# EAGLE schematic Cablaggio_Vettura_AfterHockenheim (EAGLE 7.5.0)

## Sheet 1 of 7: Main
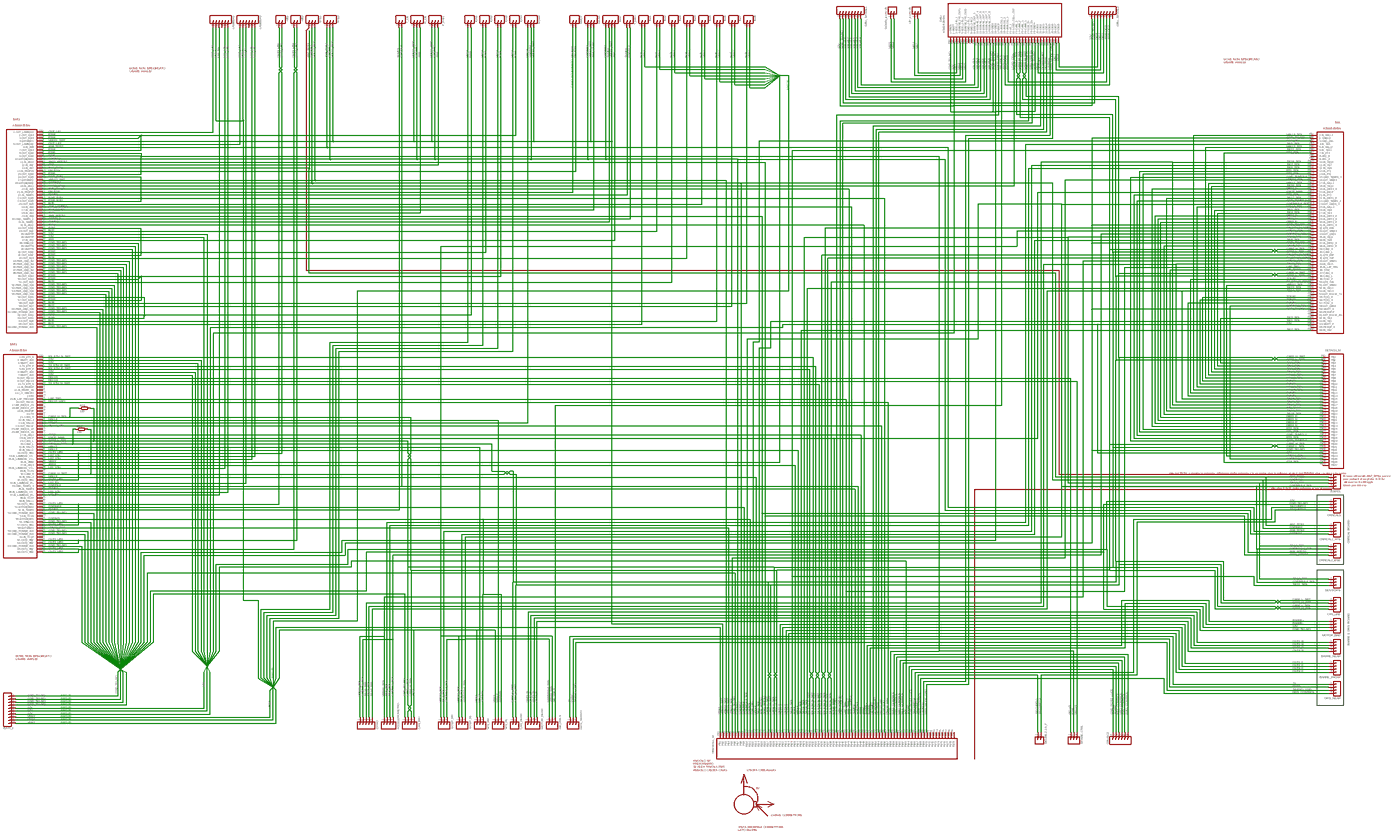
[diagram p0: schematic, sheet 1, overview]
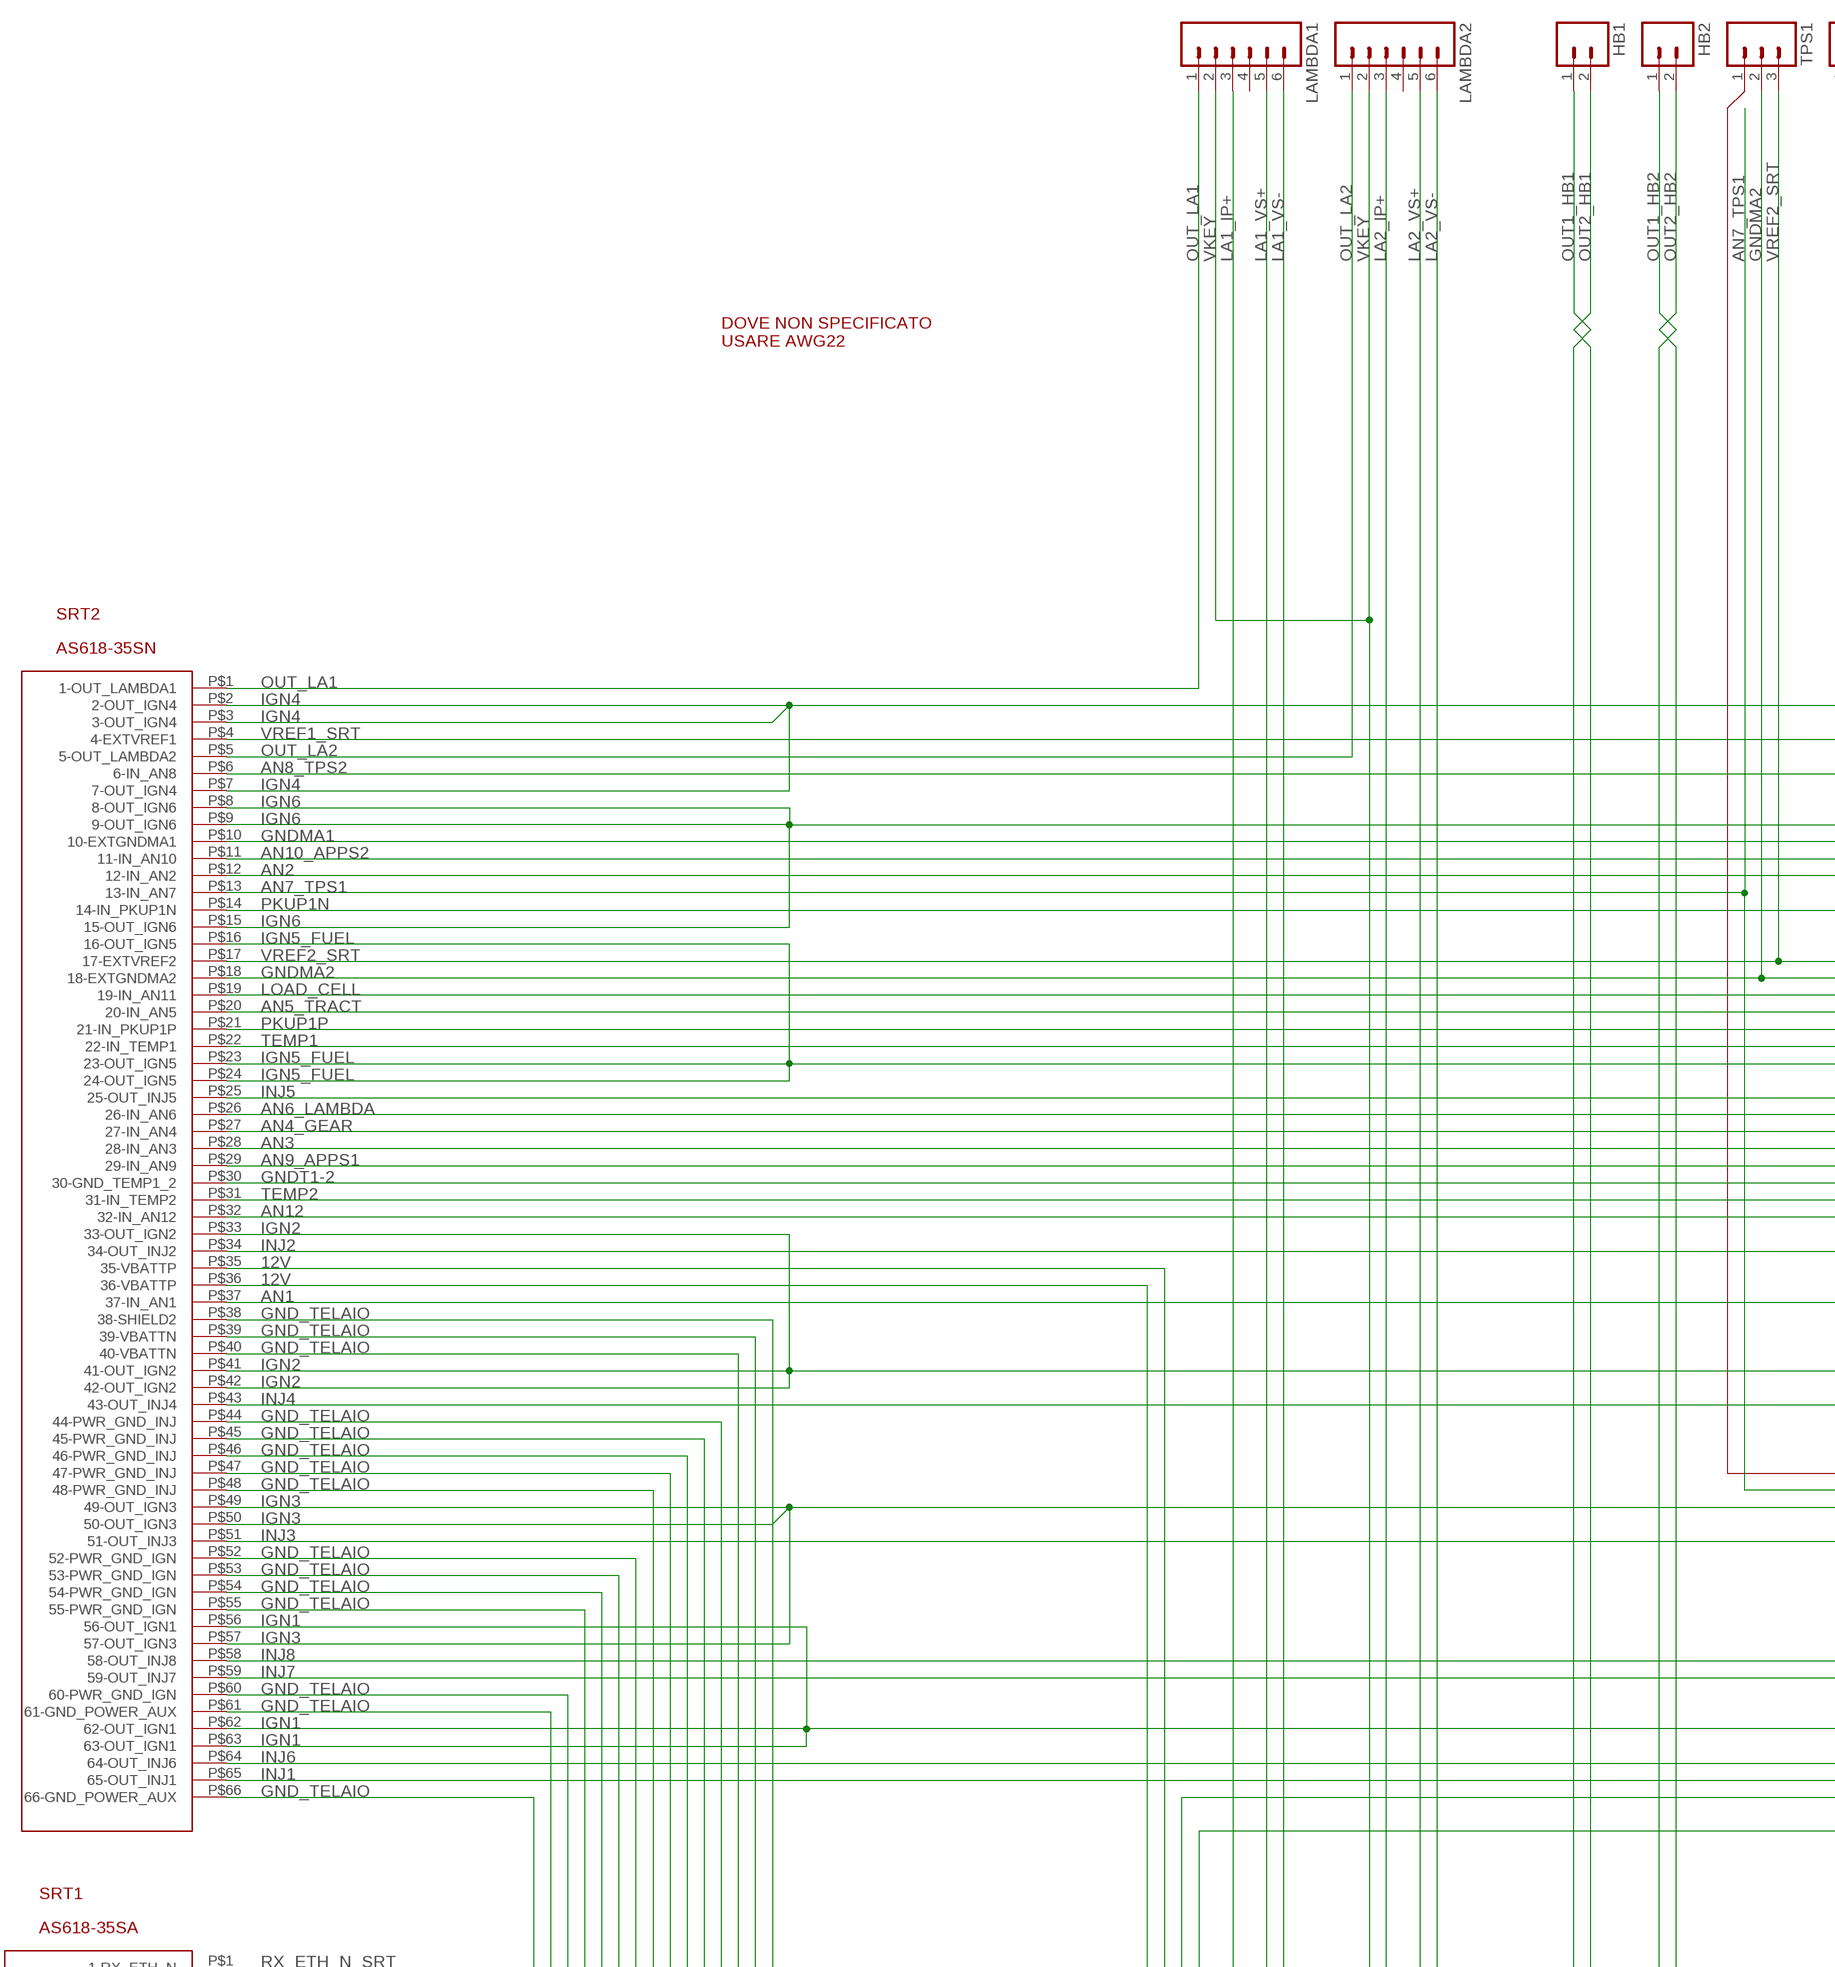
[diagram p1: schematic, sheet 1, part 1 of 8]
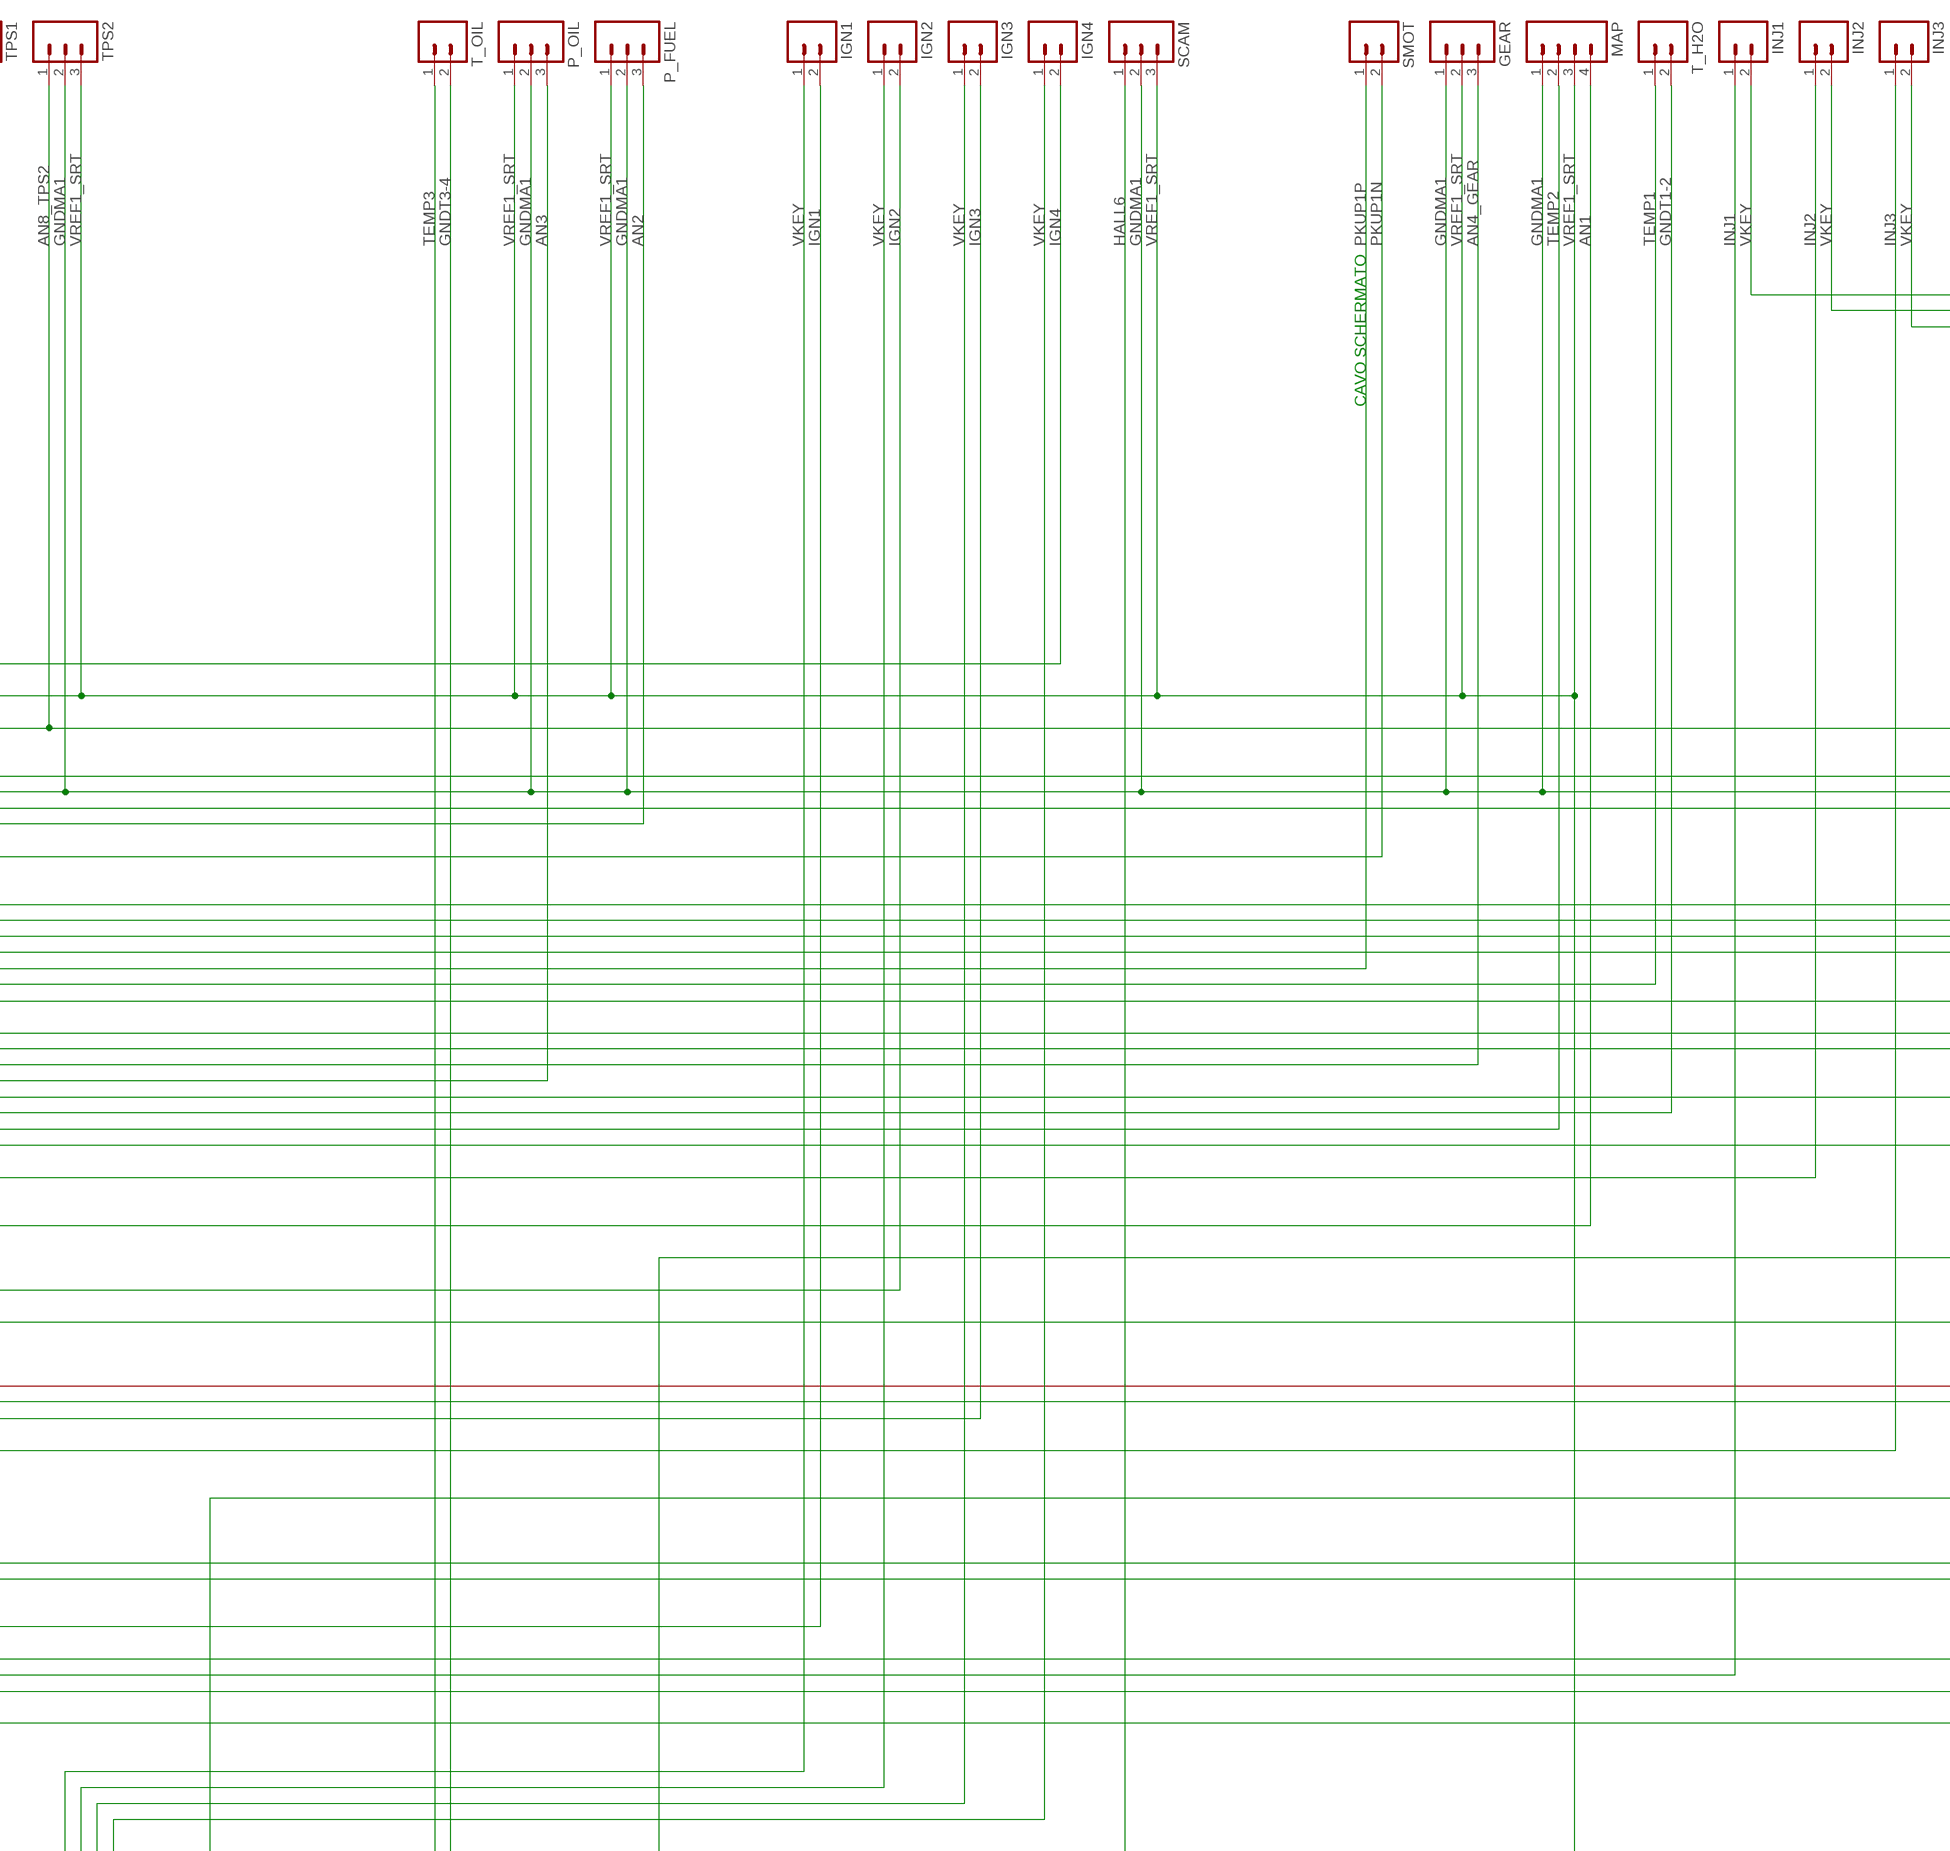
[diagram p2: schematic, sheet 1, part 2 of 8]
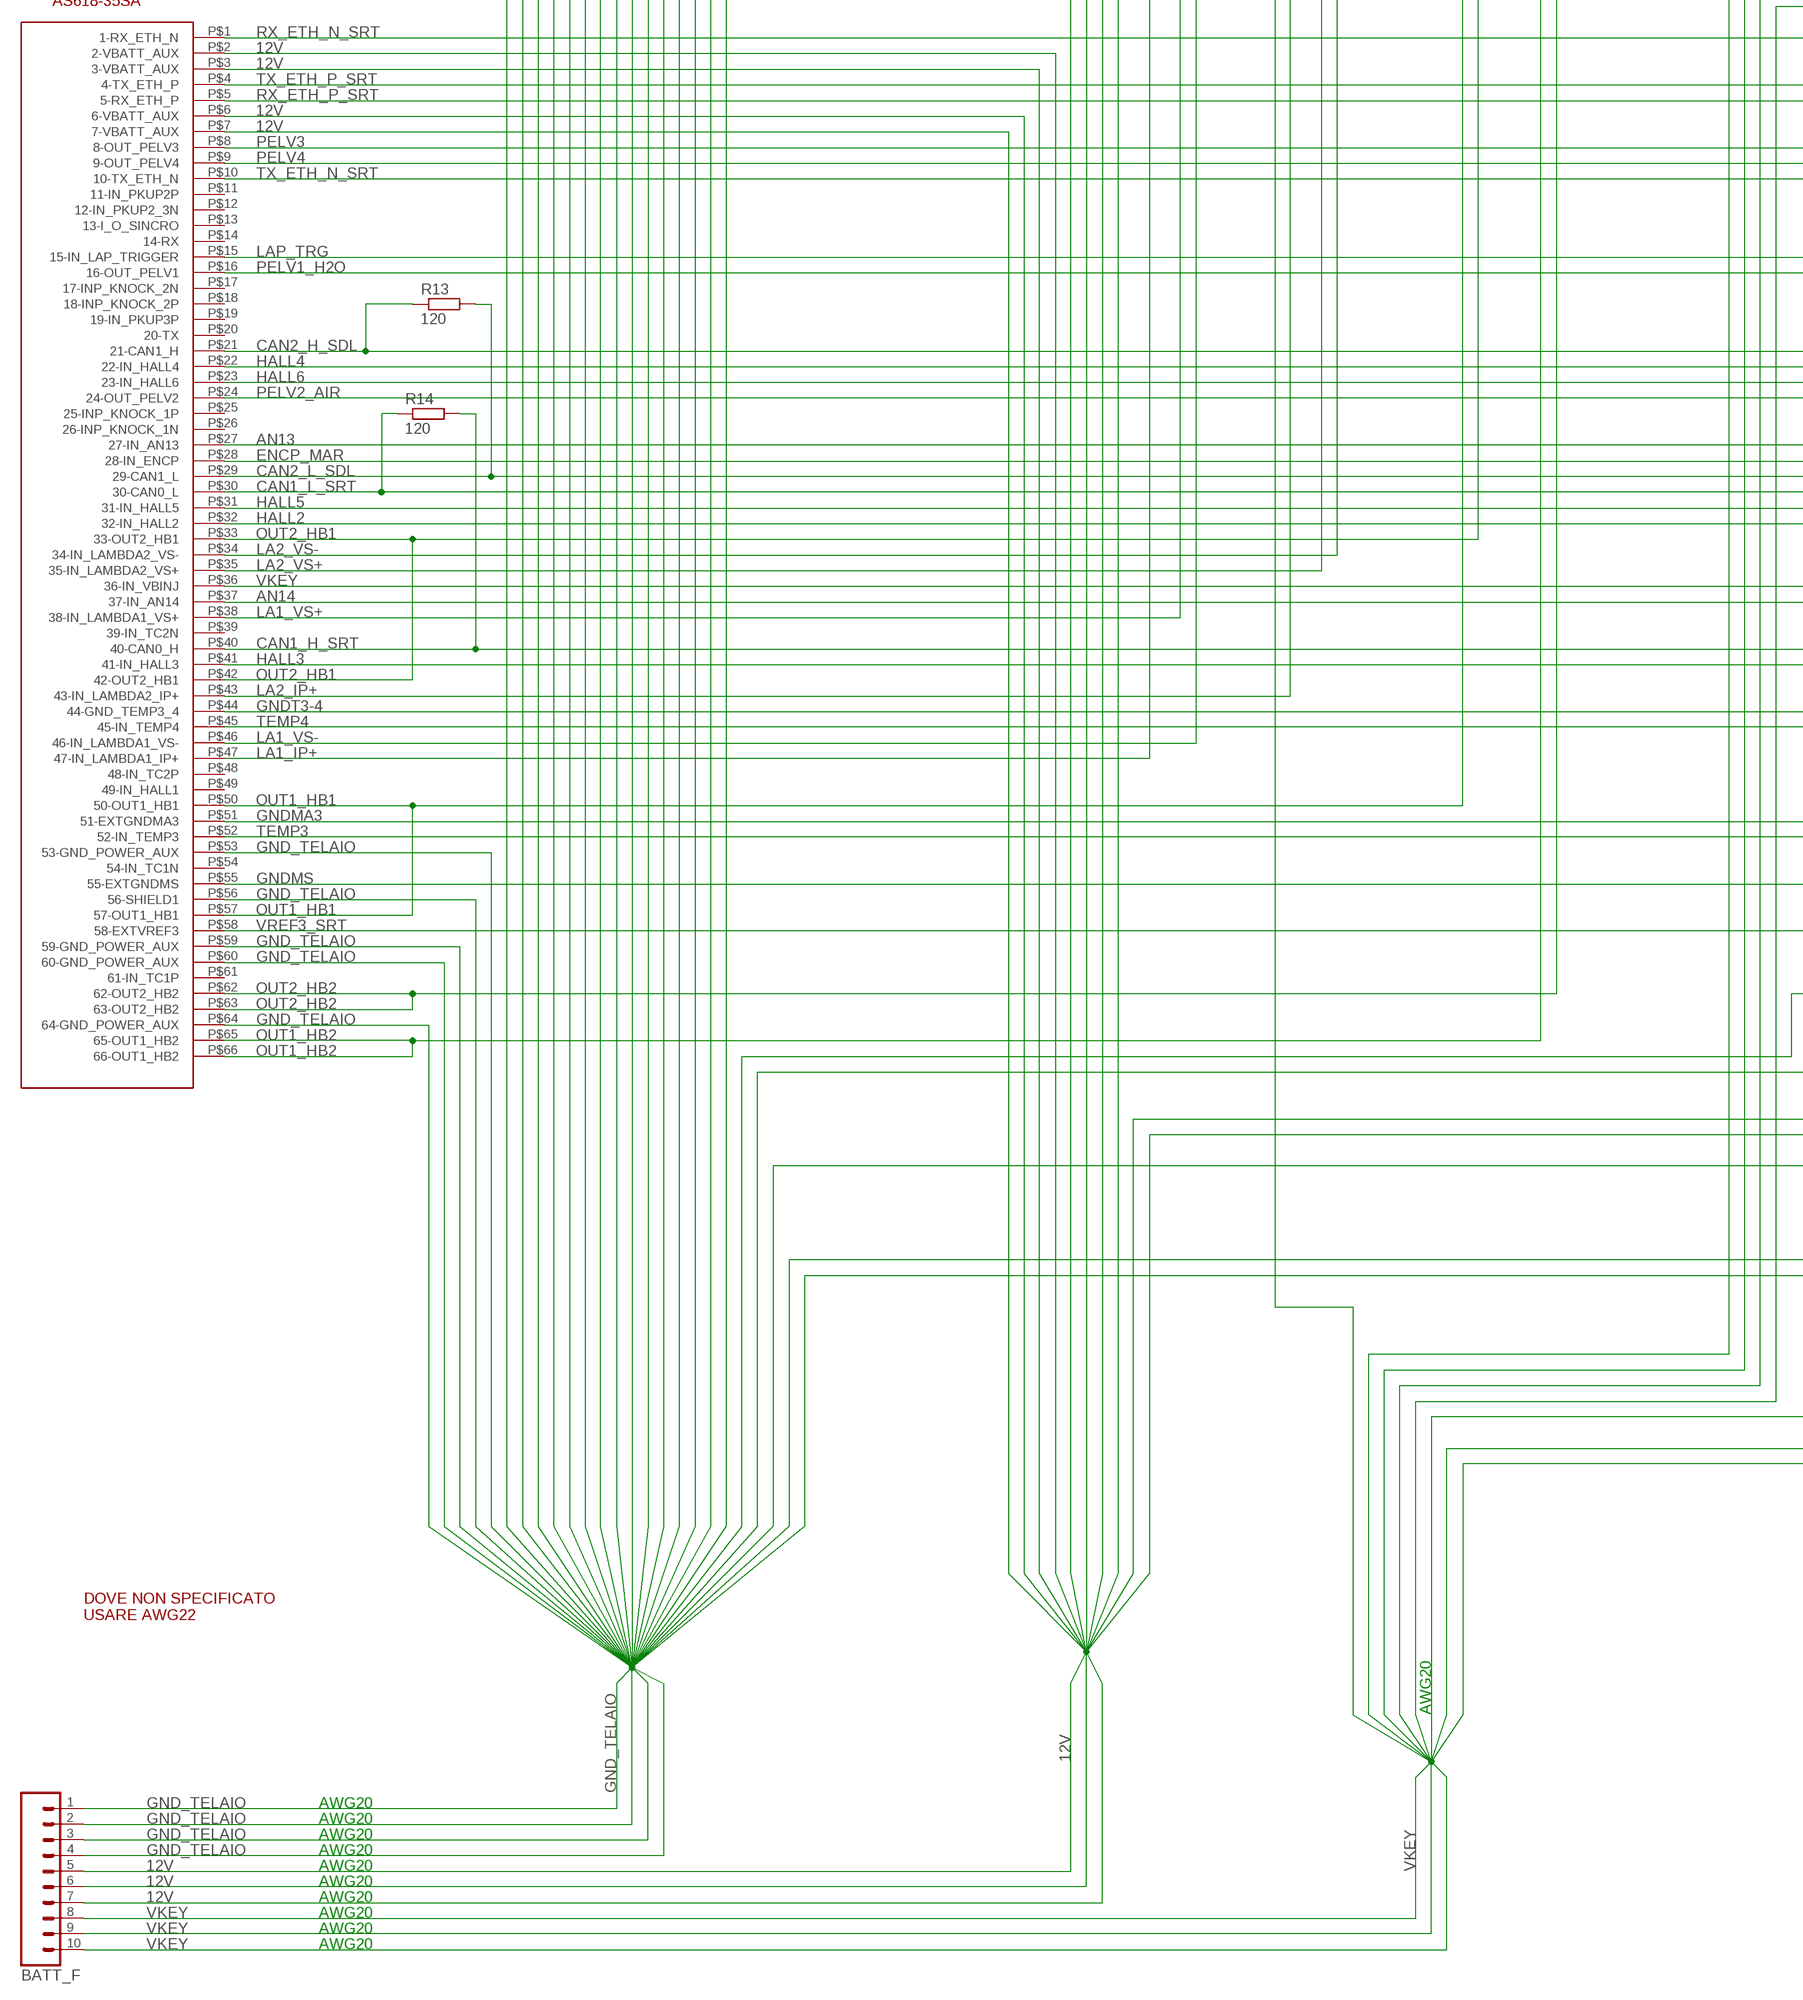
[diagram p3: schematic, sheet 1, part 3 of 8]
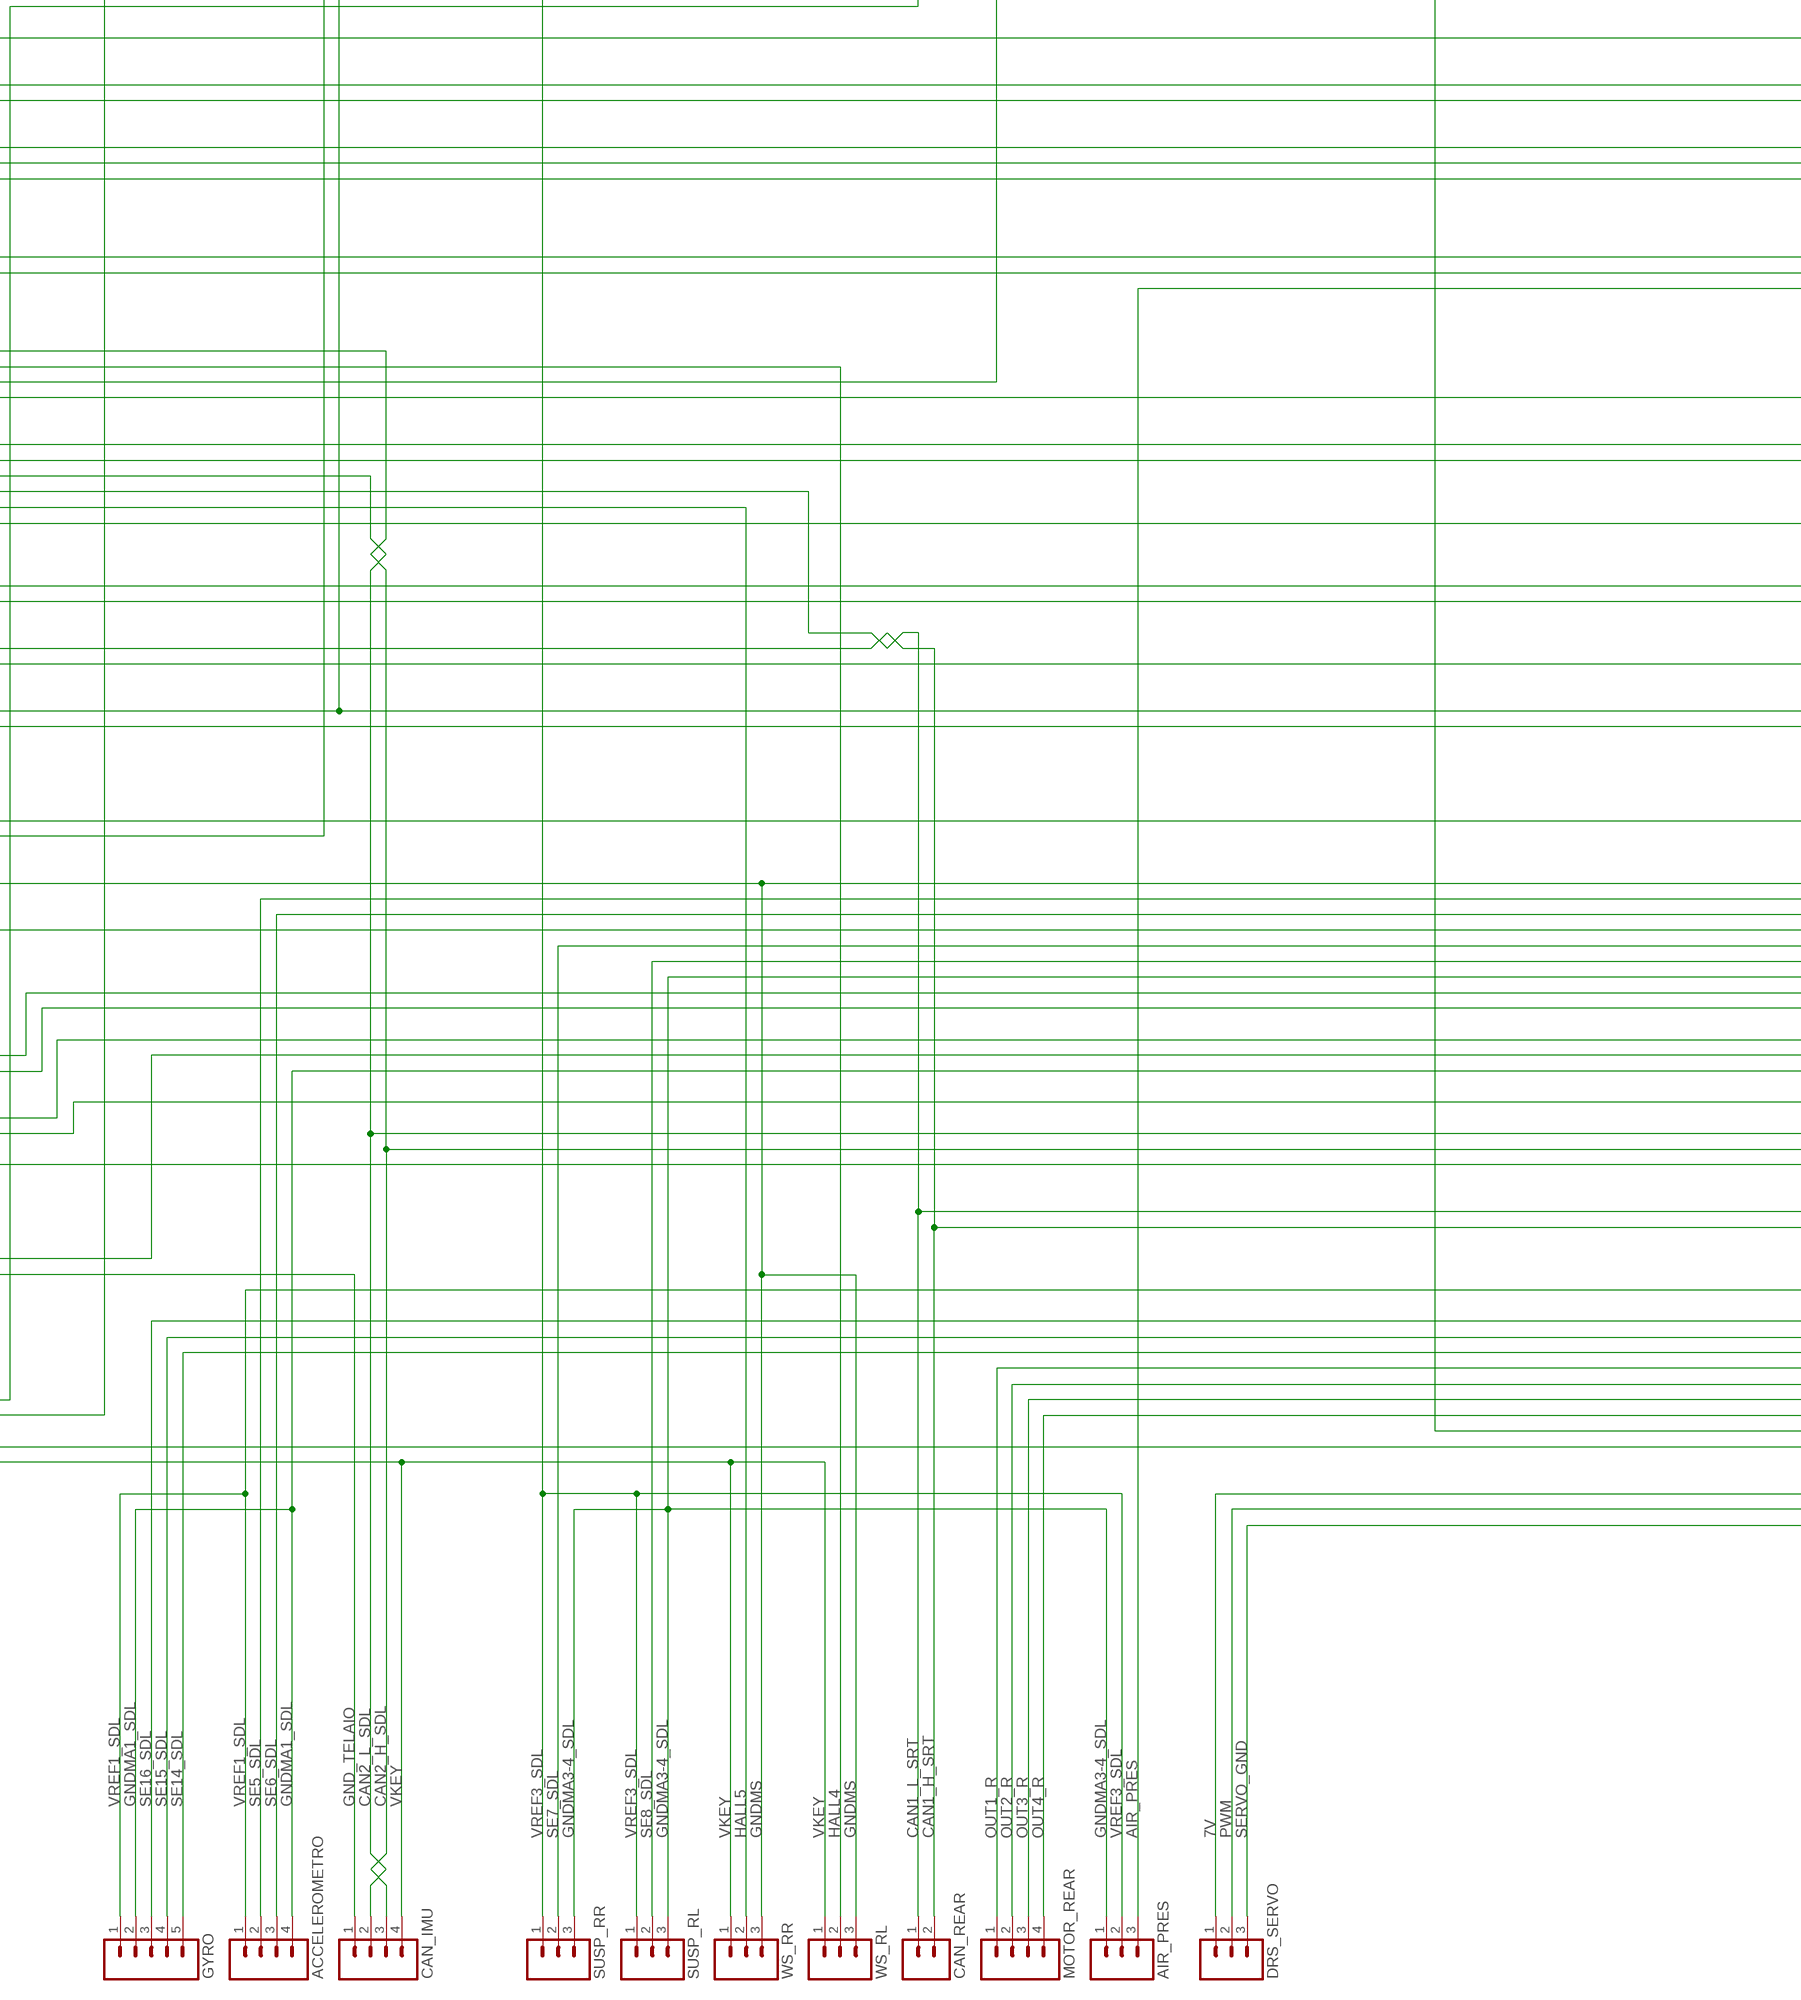
[diagram p4: schematic, sheet 1, part 4 of 8]
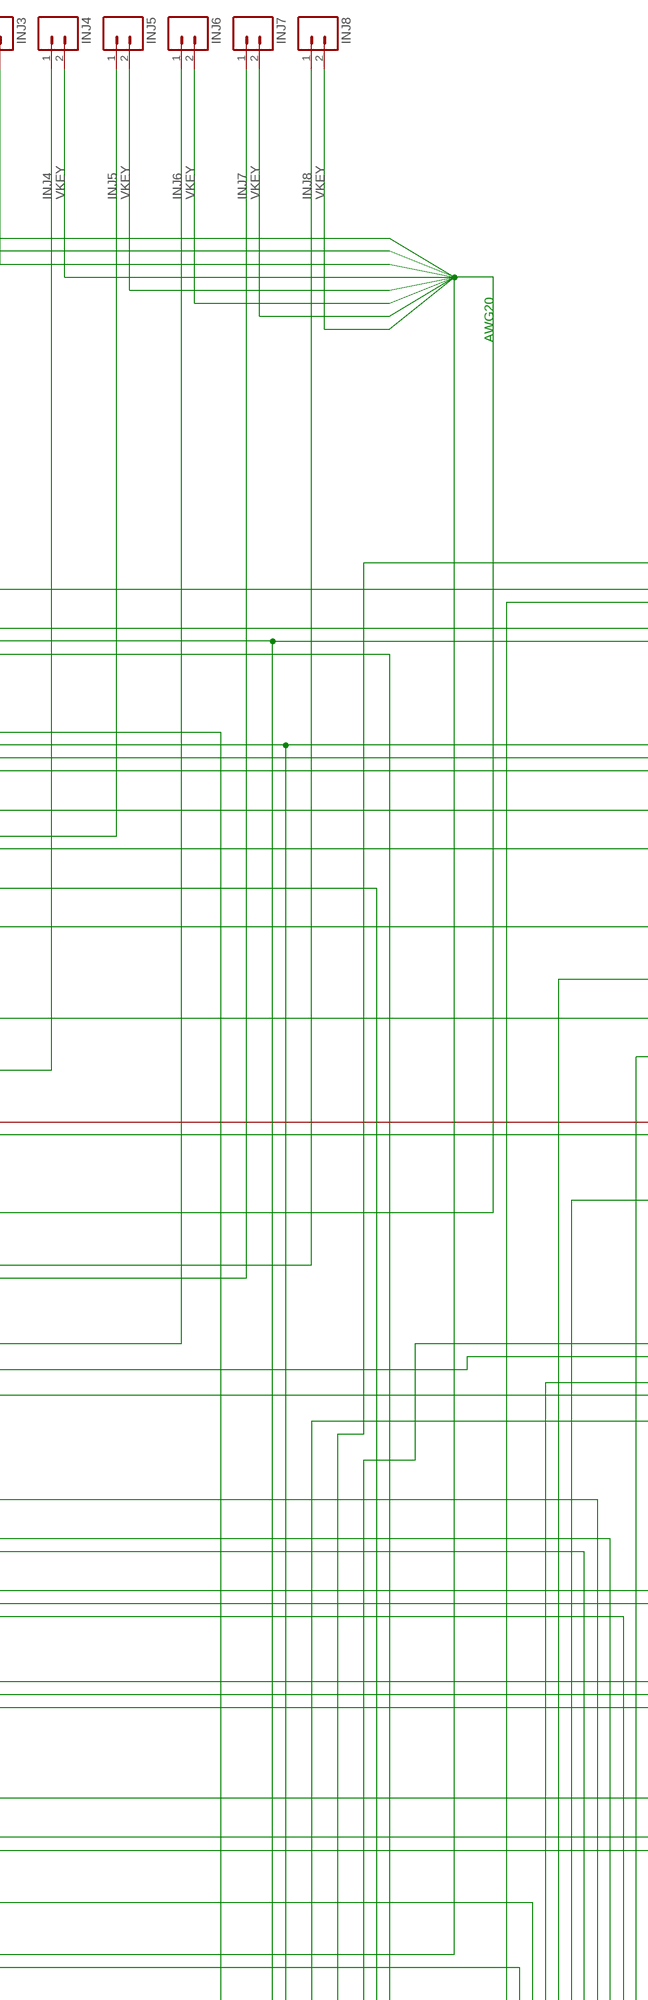
[diagram p5: schematic, sheet 1, part 5 of 8]
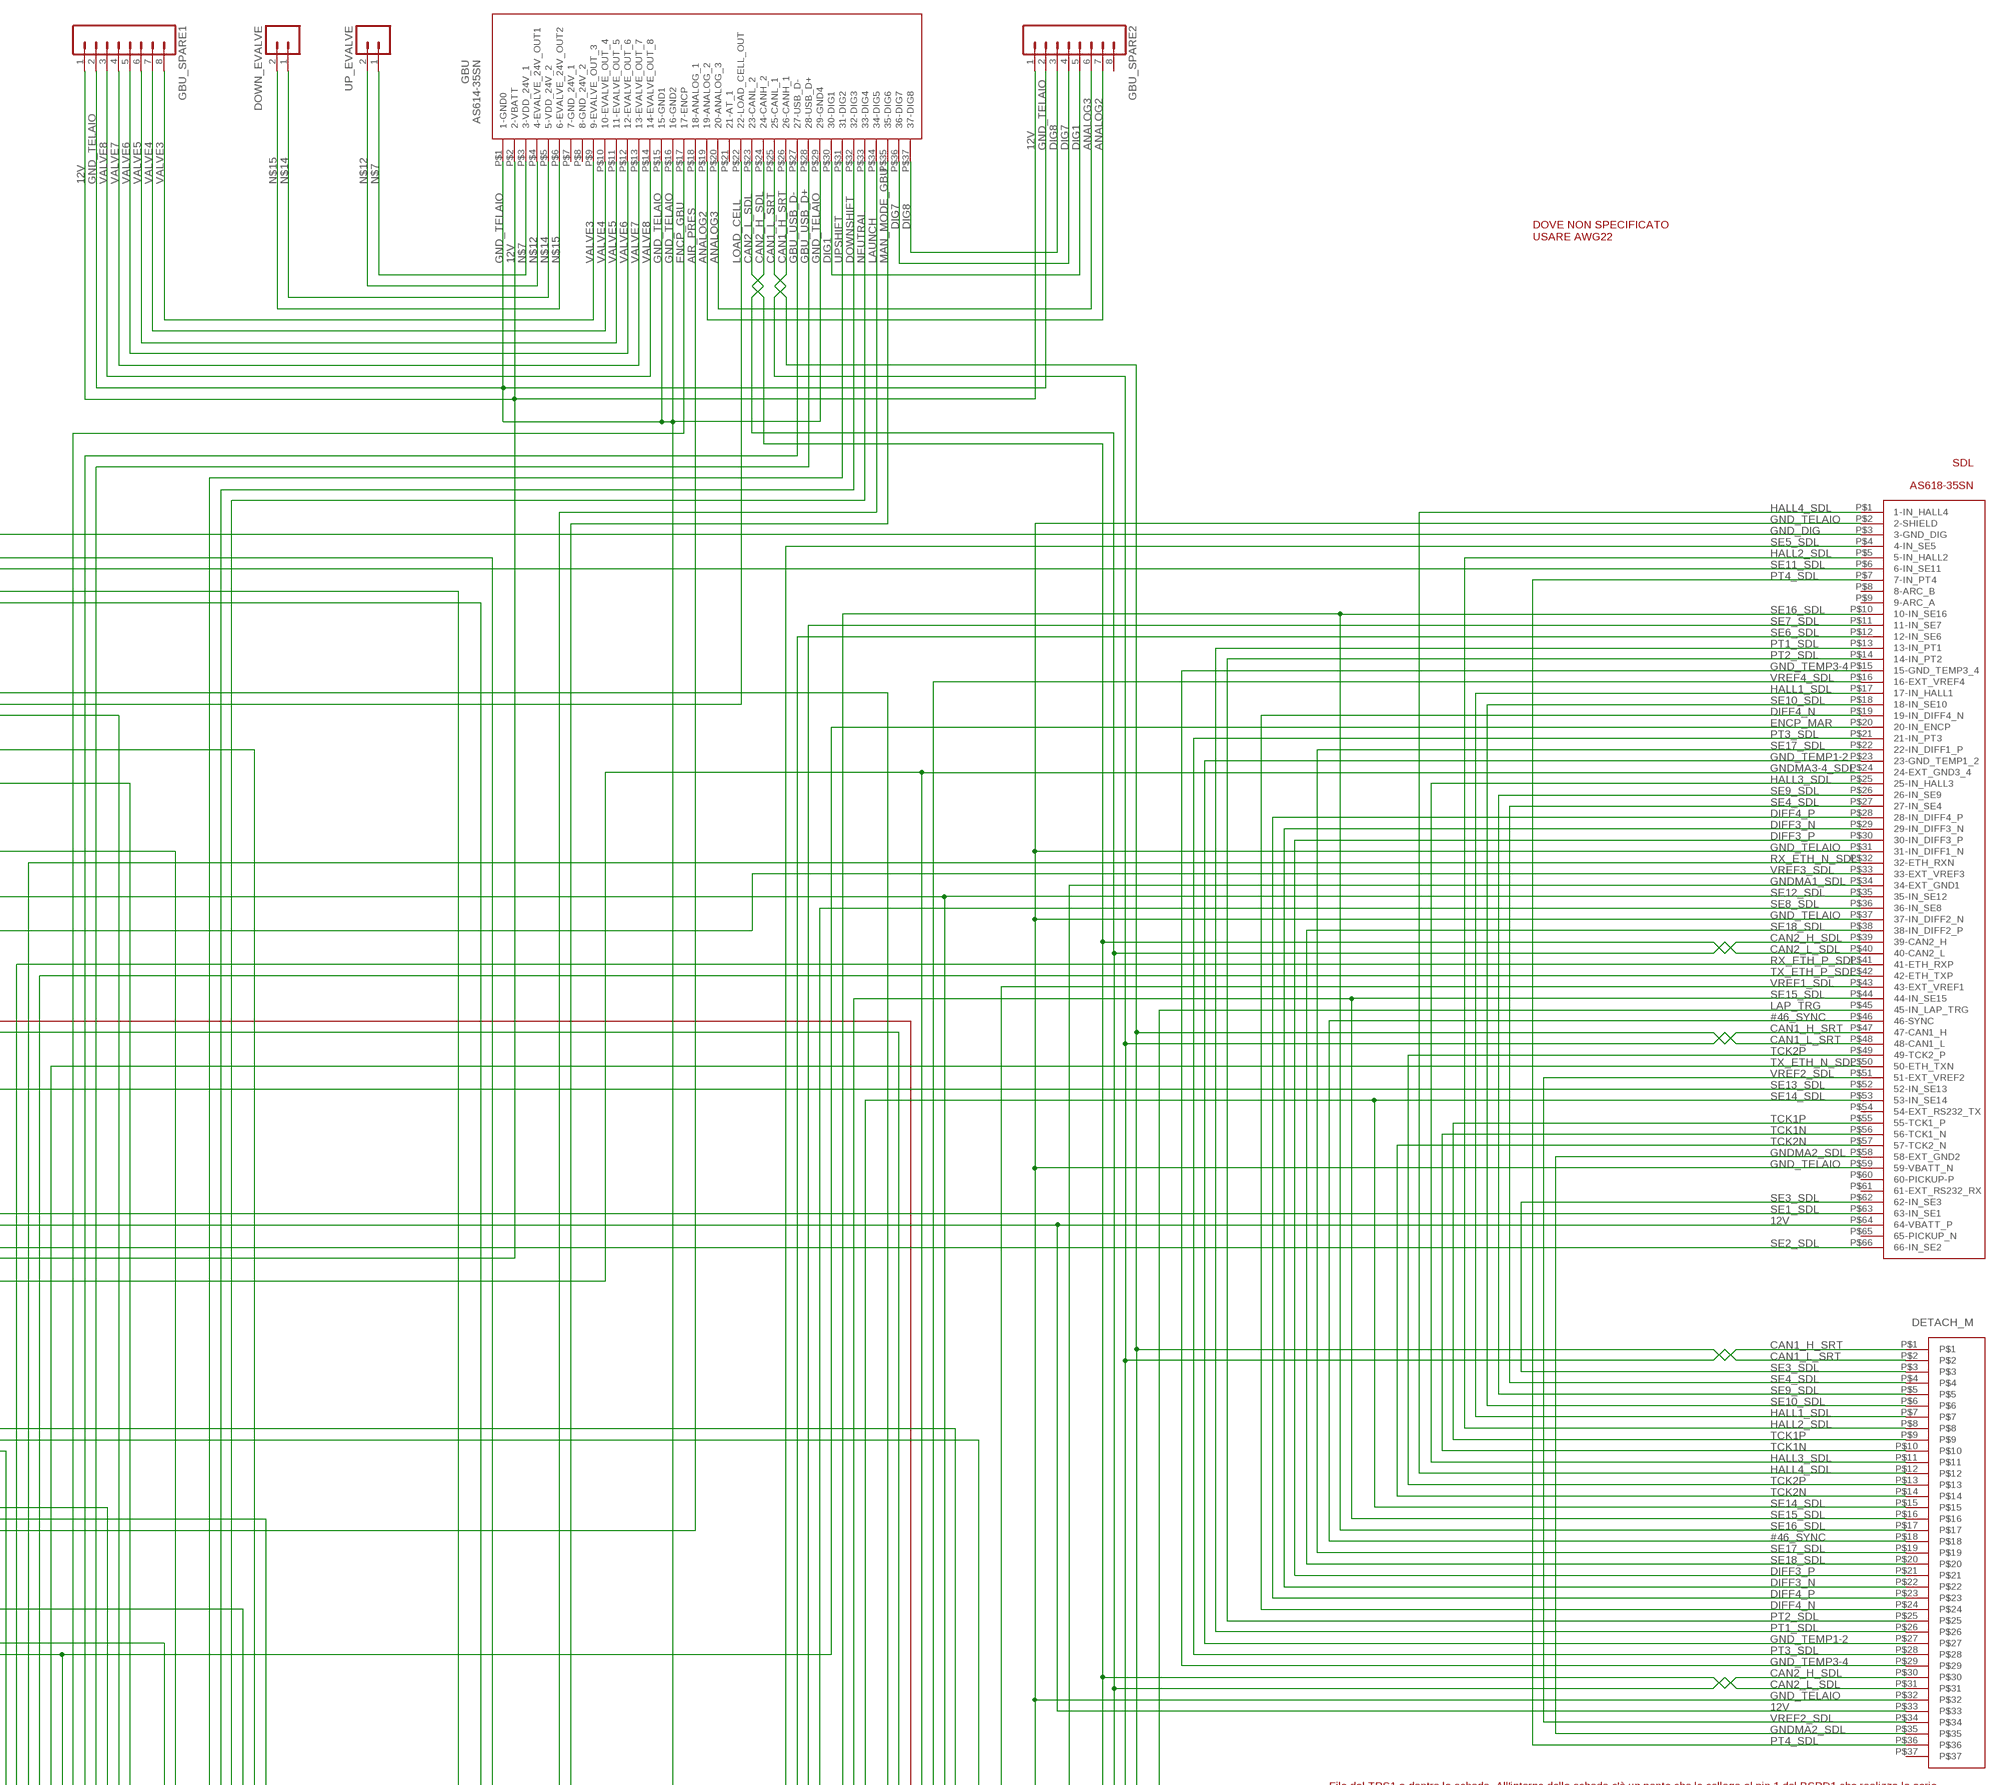
[diagram p6: schematic, sheet 1, part 6 of 8]
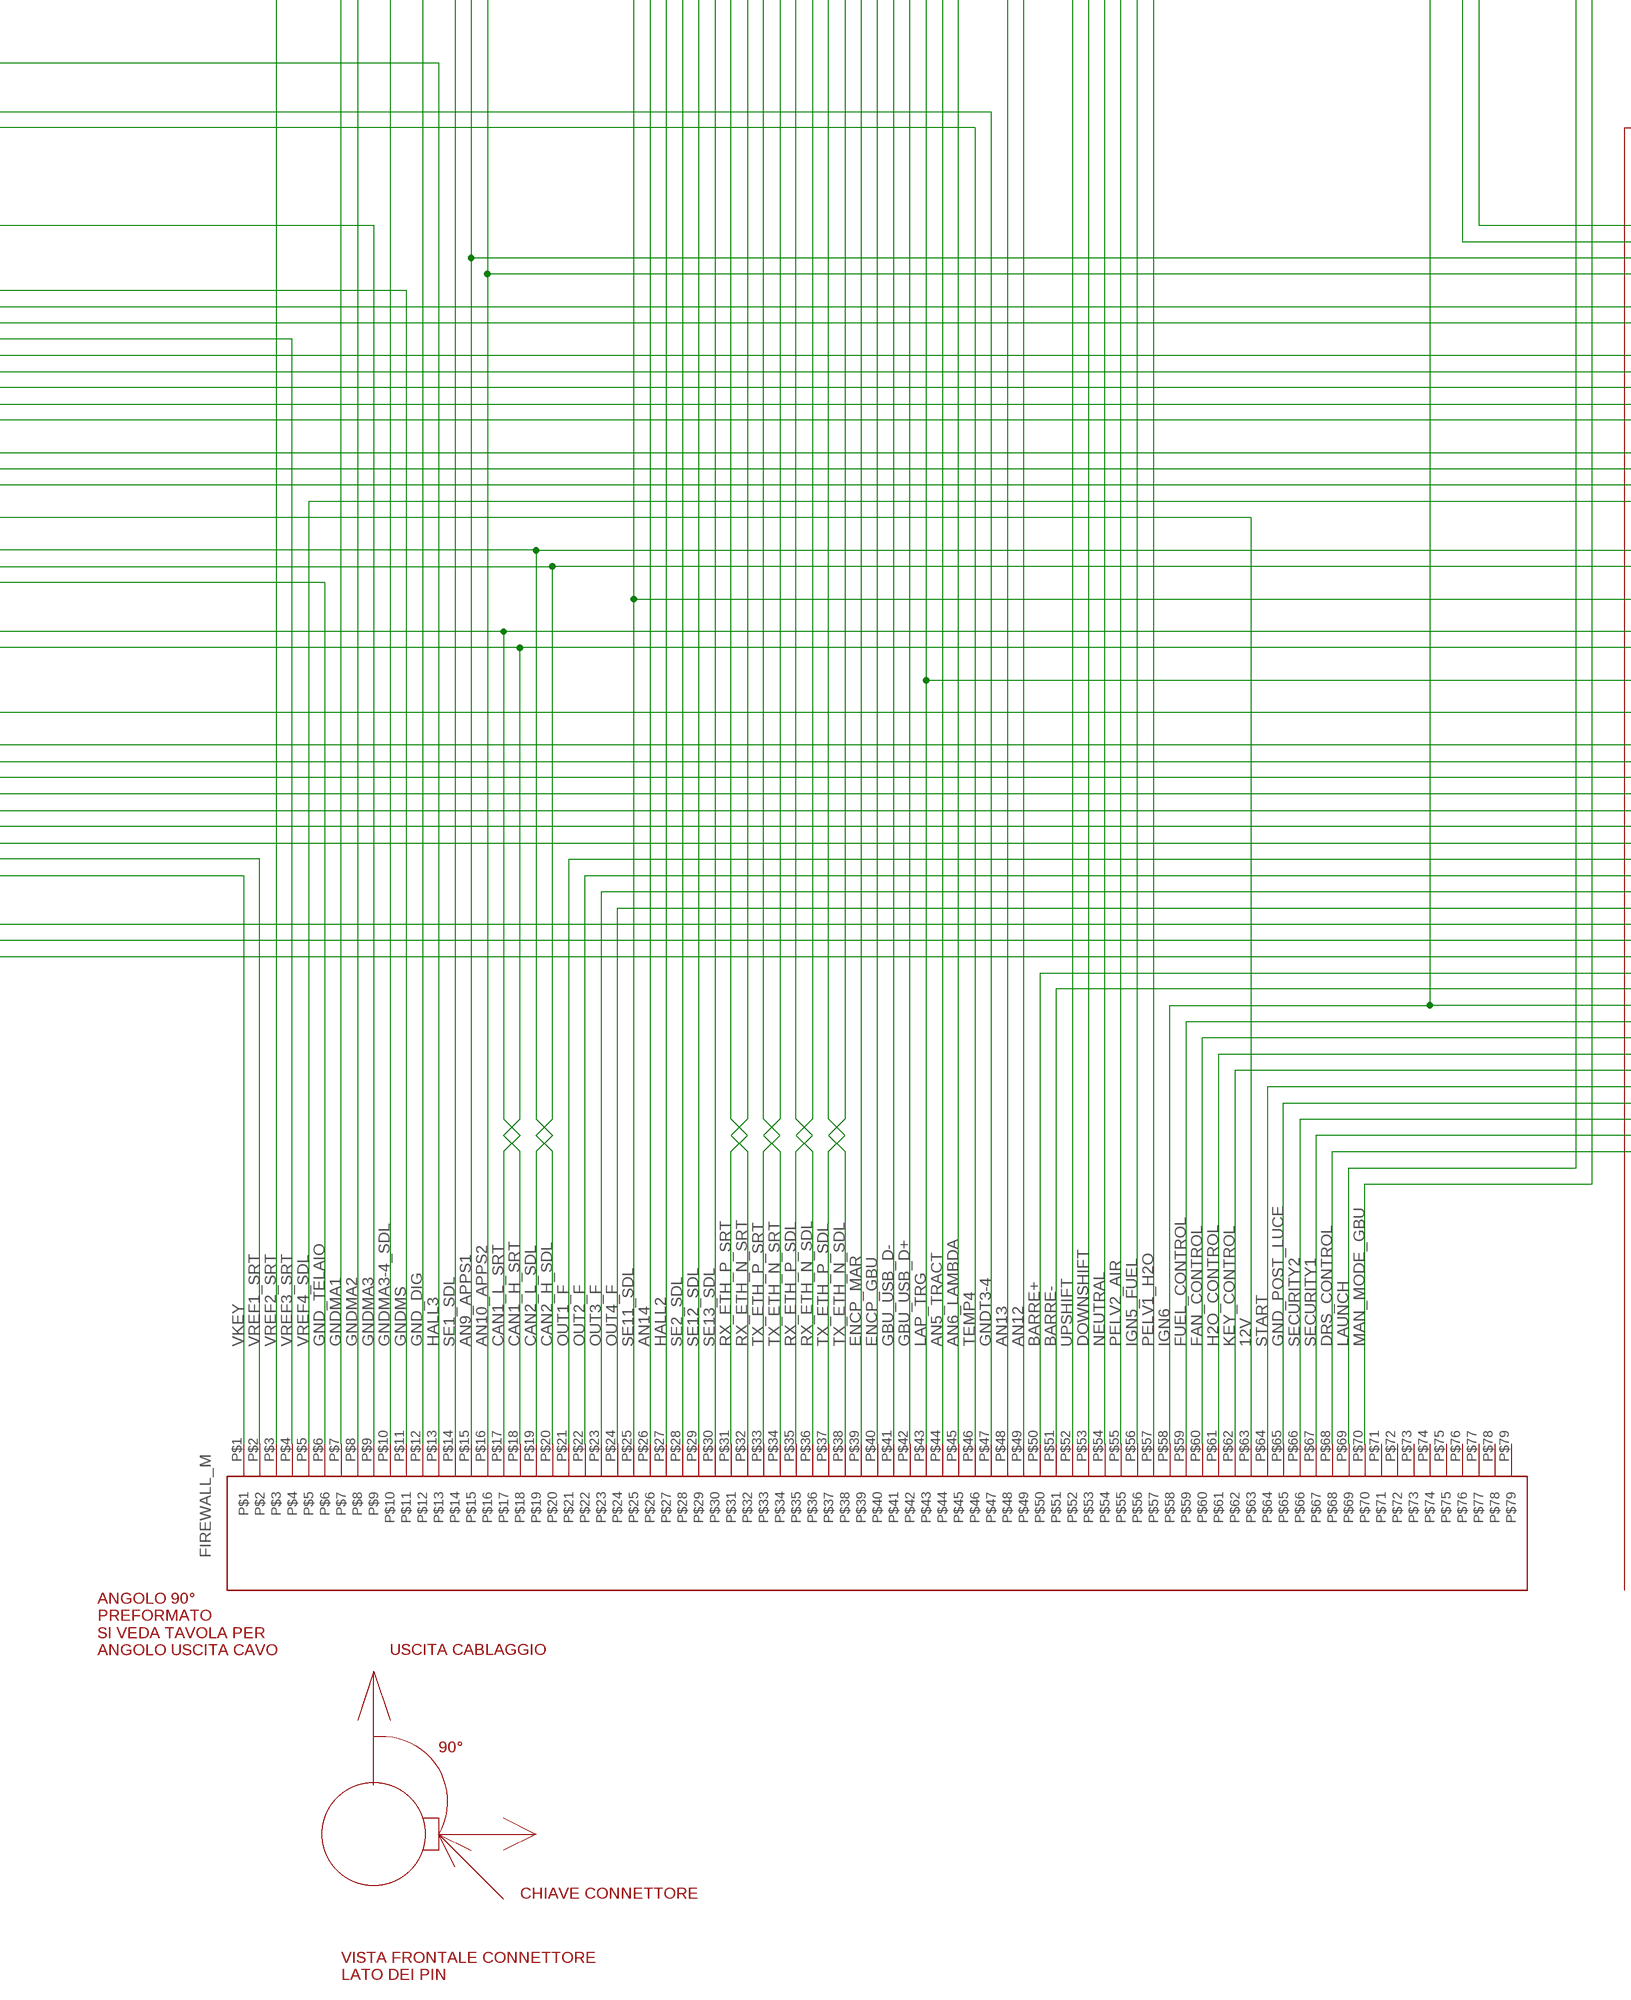
[diagram p7: schematic, sheet 1, part 7 of 8]
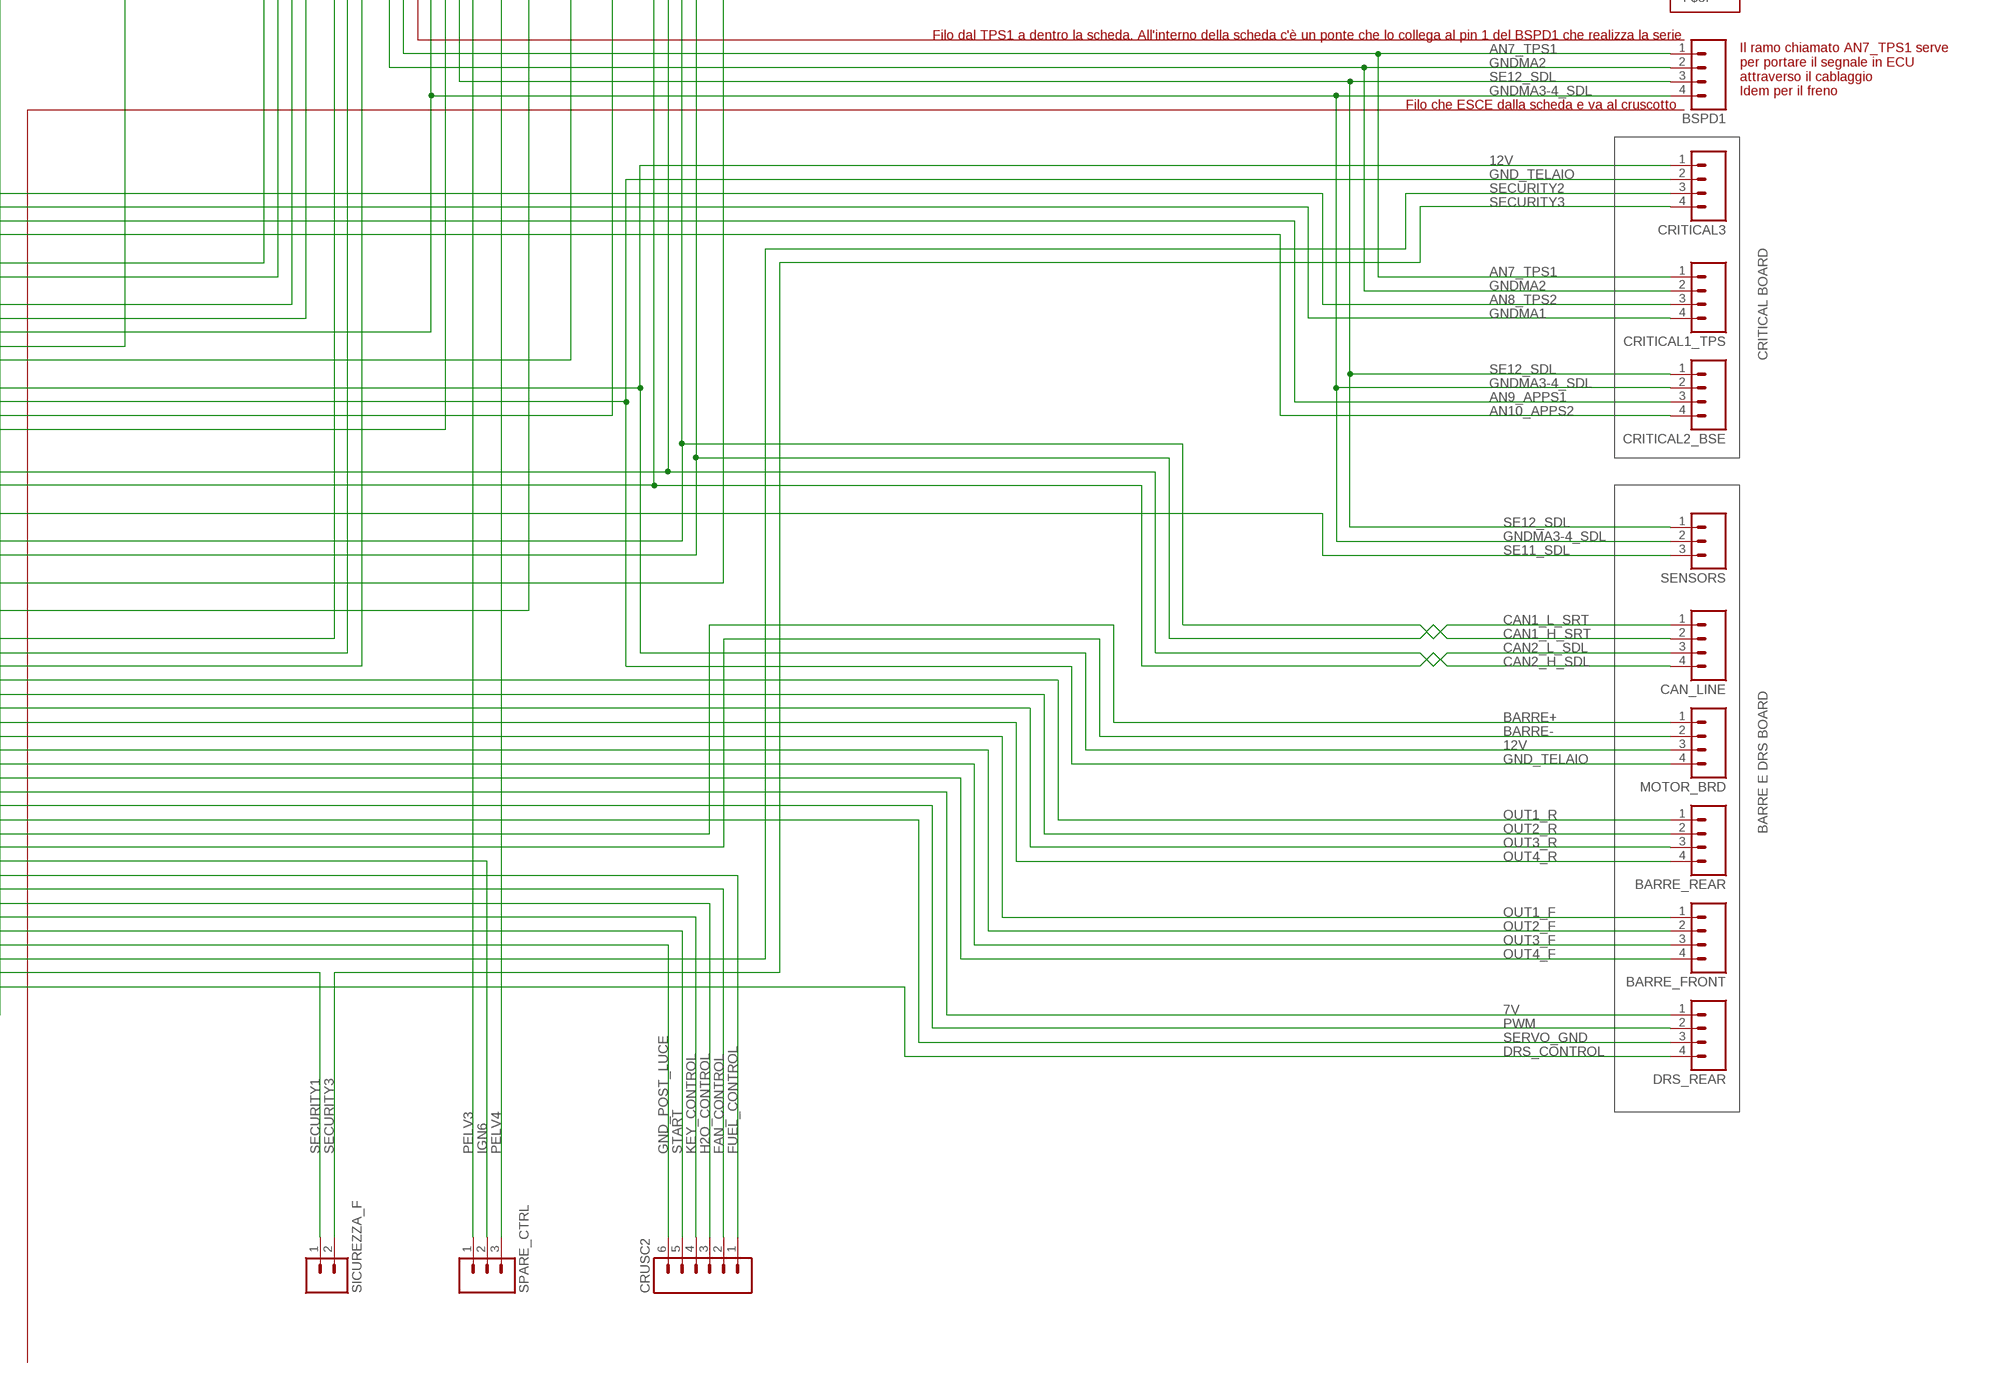
[diagram p8: schematic, sheet 1, part 8 of 8]

### Parts
ACCELEROMETRO  M04  [04P]
AIR_PRES  M03  [03P]
BARRE_FRONT  M04  [04P]
BARRE_REAR  M04  [04P]
BATT_F  M10  [10P]
BSPD1  M04  [04P]
CAN_IMU  M04  [04P]
CAN_LINE  M04  [04P]
CAN_REAR  M02  [02P]
CRITICAL1_TPS  M04  [04P]
CRITICAL2_BSE  M04  [04P]
CRITICAL3  M04  [04P]
CRUSC2  M06  [06P]
DETACH_M  37PIN_CONNECTOR  [NONE]
DOWN_EVALVE  M02  [02P]
DRS_REAR  M04  [04P]
DRS_SERVO  M03  [03P]
FIREWALL_M  79PIN_CONNECTOR  [NONE]
GBU  GBU_AS615-35SN  [NONE@2]
GBU_SPARE1  M08  [08P]
GBU_SPARE2  M08  [08P]
GEAR  M03  [03P]
GYRO  M05  [05P]
HB1  M02  [02P]
HB2  M02  [02P]
IGN1  M02  [02P]
IGN2  M02  [02P]
IGN3  M02  [02P]
IGN4  M02  [02P]
INJ1  M02  [02P]
INJ2  M02  [02P]
INJ3  M02  [02P]
INJ4  M02  [02P]
INJ5  M02  [02P]
INJ6  M02  [02P]
INJ7  M02  [02P]
INJ8  M02  [02P]
LAMBDA1  M06  [06P]
LAMBDA2  M06  [06P]
MAP  M04  [04P]
MOTOR_BRD  M04  [04P]
MOTOR_REAR  M04  [04P]
P_FUEL  M03  [03P]
P_OIL  M03  [03P]
R13  120  R-EU_0204/2V  [0204V]
R14  120  R-EU_0204/2V  [0204V]
SCAM  M03  [03P]
SENSORS  M03  [03P]
SICUREZZA_F  M02  [02P]
SMOT  M02  [02P]
SPARE_CTRL  M03  [03P]
SUSP_RL  M03  [03P]
SUSP_RR  M03  [03P]
T_H2O  M02  [02P]
T_OIL  M02  [02P]
TPS1  M03  [03P]
TPS2  M03  [03P]
U$1  SRT_AS618-35SA  [NONE]
U$2  SRT_AS618-35SN  [NONE]
U$3  SDL_AS618-35SN  [NONE]
UP_EVALVE  M02  [02P]
WS_RL  M03  [03P]
WS_RR  M03  [03P]

### Nets
7V: DRS_REAR.1 DRS_SERVO.1
12V: BATT_F.5 BATT_F.6 BATT_F.7 CRITICAL3.1 DETACH_M.P$33 FIREWALL_M.P$63 GBU.P$2(2-VBATT) GBU_SPARE1.1 GBU_SPARE2.1 MOTOR_BRD.3 U$1.P$2(2-VBATT_AUX) U$1.P$3(3-VBATT_AUX) U$1.P$6(6-VBATT_AUX) U$1.P$7(7-VBATT_AUX) U$2.P$35(35-VBATTP) U$2.P$36(36-VBATTP) U$3.P$64(64-VBATT_P) ; also sheet 2,3,4,6,7
#46_SYNC: DETACH_M.P$18 U$3.P$46(46-SYNC) ; also sheet 3
AIR_PRES: AIR_PRES.3 GBU.P$18(18-ANALOG_1)
AN1: MAP.4 U$2.P$37(37-IN_AN1)
AN2: P_FUEL.3 U$2.P$12(12-IN_AN2)
AN3: P_OIL.3 U$2.P$28(28-IN_AN3)
AN4_GEAR: GEAR.3 U$2.P$27(27-IN_AN4)
AN5_TRACT: FIREWALL_M.P$44 U$2.P$20(20-IN_AN5) ; also sheet 2,6
AN6_LAMBDA: FIREWALL_M.P$45 U$2.P$26(26-IN_AN6) ; also sheet 2,6
AN7_TPS1: BSPD1.1 CRITICAL1_TPS.1 U$2.P$13(13-IN_AN7)
AN8_TPS2: CRITICAL1_TPS.3 TPS2.1 U$2.P$6(6-IN_AN8)
AN9_APPS1: CRITICAL2_BSE.3 FIREWALL_M.P$15 U$2.P$29(29-IN_AN9) ; also sheet 2
AN10_APPS2: CRITICAL2_BSE.4 FIREWALL_M.P$16 U$2.P$11(11-IN_AN10) ; also sheet 2
AN12: FIREWALL_M.P$49 U$2.P$32(32-IN_AN12) ; also sheet 2,6
AN13: FIREWALL_M.P$48 U$1.P$27(27-IN_AN13) ; also sheet 2,6
AN14: FIREWALL_M.P$26 U$1.P$37(37-IN_AN14) ; also sheet 2
ANALOG2: GBU.P$19(19-ANALOG_2) GBU_SPARE2.7
ANALOG3: GBU.P$20(20-ANALOG_3) GBU_SPARE2.6
BARRE+: FIREWALL_M.P$50 MOTOR_BRD.1 ; also sheet 2
BARRE-: FIREWALL_M.P$51 MOTOR_BRD.2 ; also sheet 2
CAN1_H_SRT: CAN_LINE.2 CAN_REAR.2 DETACH_M.P$1 FIREWALL_M.P$18 GBU.P$26(26-CANH_1) R14.2 U$1.P$40(40-CAN0_H) U$3.P$47(47-CAN1_H) ; also sheet 2,3,6
CAN1_L_SRT: CAN_LINE.1 CAN_REAR.1 DETACH_M.P$2 FIREWALL_M.P$17 GBU.P$25(25-CANL_1) R14.1 U$1.P$30(30-CAN0_L) U$3.P$48(48-CAN1_L) ; also sheet 2,3,6
CAN2_H_SDL: CAN_IMU.3 CAN_LINE.4 DETACH_M.P$30 FIREWALL_M.P$20 GBU.P$24(24-CANH_2) R13.1 U$1.P$21(21-CAN1_H) U$3.P$39(39-CAN2_H) ; also sheet 2,3
CAN2_L_SDL: CAN_IMU.2 CAN_LINE.3 DETACH_M.P$31 FIREWALL_M.P$19 GBU.P$23(23-CANL_2) R13.2 U$1.P$29(29-CAN1_L) U$3.P$40(40-CAN2_L) ; also sheet 2,3
DIFF3_N: DETACH_M.P$22 U$3.P$29(29-IN_DIFF3_N) ; also sheet 3
DIFF3_P: DETACH_M.P$21 U$3.P$30(30-IN_DIFF3_P) ; also sheet 3
DIFF4_N: DETACH_M.P$24 U$3.P$19(19-IN_DIFF4_N) ; also sheet 3
DIFF4_P: DETACH_M.P$23 U$3.P$28(28-IN_DIFF4_P) ; also sheet 3
DIG1: GBU.P$30(30-DIG1) GBU_SPARE2.5
DIG7: GBU.P$36(36-DIG7) GBU_SPARE2.4
DIG8: GBU.P$37(37-DIG8) GBU_SPARE2.3
DOWNSHIFT: FIREWALL_M.P$53 GBU.P$32(32-DIG3) ; also sheet 2
DRS_CONTROL: DRS_REAR.4 FIREWALL_M.P$68 ; also sheet 2,6
ENCP_GBU: FIREWALL_M.P$40 GBU.P$17(17-ENCP) ; also sheet 2,5
ENCP_MAR: FIREWALL_M.P$39 U$1.P$28(28-IN_ENCP) U$3.P$20(20-IN_ENCP) ; also sheet 2,5
FAN_CONTROL: CRUSC2.2 FIREWALL_M.P$60 ; also sheet 2,4,6,7
FUEL_CONTROL: CRUSC2.1 FIREWALL_M.P$59 ; also sheet 2,4,6,7
GBU_USB_D+: FIREWALL_M.P$42 GBU.P$28(28-USB_D+) ; also sheet 2,5
GBU_USB_D-: FIREWALL_M.P$41 GBU.P$27(27-USB_D-) ; also sheet 2,5
GND_DIG: FIREWALL_M.P$12 U$3.P$3(3-GND_DIG) ; also sheet 2
GND_POST_LUCE: CRUSC2.6 FIREWALL_M.P$65 ; also sheet 2,4
GND_TELAIO: BATT_F.1 BATT_F.2 BATT_F.3 BATT_F.4 CAN_IMU.1 CRITICAL3.2 DETACH_M.P$32 FIREWALL_M.P$6 GBU.P$1(1-GND0) GBU.P$15(15-GND1) GBU.P$16(16-GND2) GBU.P$29(29-GND4) GBU_SPARE1.2 GBU_SPARE2.2 MOTOR_BRD.4 U$1.P$53(53-GND_POWER_AUX) U$1.P$56(56-SHIELD1) U$1.P$59(59-GND_POWER_AUX) U$1.P$60(60-GND_POWER_AUX) U$1.P$64(64-GND_POWER_AUX) U$2.P$38(38-SHIELD2) U$2.P$39(39-VBATTN) U$2.P$40(40-VBATTN) U$2.P$44(44-PWR_GND_INJ) U$2.P$45(45-PWR_GND_INJ) U$2.P$46(46-PWR_GND_INJ) U$2.P$47(47-PWR_GND_INJ) U$2.P$48(48-PWR_GND_INJ) U$2.P$52(52-PWR_GND_IGN) U$2.P$53(53-PWR_GND_IGN) U$2.P$54(54-PWR_GND_IGN) U$2.P$55(55-PWR_GND_IGN) U$2.P$60(60-PWR_GND_IGN) U$2.P$61(61-GND_POWER_AUX) U$2.P$66(66-GND_POWER_AUX) U$3.P$2(2-SHIELD) U$3.P$31(31-IN_DIFF1_N) U$3.P$37(37-IN_DIFF2_N) U$3.P$59(59-VBATT_N) ; also sheet 2,3,4,5,6
GND_TEMP1-2: DETACH_M.P$27 U$3.P$23(23-GND_TEMP1_2) ; also sheet 3
GND_TEMP3-4: DETACH_M.P$29 U$3.P$15(15-GND_TEMP3_4) ; also sheet 3
GNDMA1: CRITICAL1_TPS.4 FIREWALL_M.P$7 GEAR.1 MAP.1 P_FUEL.2 P_OIL.2 SCAM.2 TPS2.2 U$2.P$10(10-EXTGNDMA1)
GNDMA1_SDL: ACCELEROMETRO.4 GYRO.2 U$3.P$34(34-EXT_GND1)
GNDMA2: BSPD1.2 CRITICAL1_TPS.2 FIREWALL_M.P$8 TPS1.2 U$2.P$18(18-EXTGNDMA2)
GNDMA2_SDL: DETACH_M.P$35 U$3.P$58(58-EXT_GND2) ; also sheet 3
GNDMA3: FIREWALL_M.P$9 U$1.P$51(51-EXTGNDMA3) ; also sheet 6
GNDMA3-4_SDL: AIR_PRES.1 BSPD1.4 CRITICAL2_BSE.2 FIREWALL_M.P$10 SENSORS.2 SUSP_RL.3 SUSP_RR.3 U$3.P$24(24-EXT_GND3_4) ; also sheet 2
GNDMS: FIREWALL_M.P$11 U$1.P$55(55-EXTGNDMS) WS_RL.3 WS_RR.3 ; also sheet 2
GNDT1-2: T_H2O.2 U$2.P$30(30-GND_TEMP1_2)
GNDT3-4: FIREWALL_M.P$47 T_OIL.2 U$1.P$44(44-GND_TEMP3_4) ; also sheet 2,6
H2O_CONTROL: CRUSC2.3 FIREWALL_M.P$61 ; also sheet 2,6,7
HALL1_SDL: DETACH_M.P$7 U$3.P$17(17-IN_HALL1) ; also sheet 3
HALL2: FIREWALL_M.P$27 U$1.P$32(32-IN_HALL2) ; also sheet 2
HALL2_SDL: DETACH_M.P$8 U$3.P$5(5-IN_HALL2) ; also sheet 3
HALL3: FIREWALL_M.P$13 U$1.P$41(41-IN_HALL3) ; also sheet 2
HALL3_SDL: DETACH_M.P$11 U$3.P$25(25-IN_HALL3) ; also sheet 3
HALL4: U$1.P$22(22-IN_HALL4) WS_RL.2
HALL4_SDL: DETACH_M.P$12 U$3.P$1(1-IN_HALL4) ; also sheet 3
HALL5: U$1.P$31(31-IN_HALL5) WS_RR.2
HALL6: SCAM.1 U$1.P$23(23-IN_HALL6)
IGN1: IGN1.2 U$2.P$56(56-OUT_IGN1) U$2.P$62(62-OUT_IGN1) U$2.P$63(63-OUT_IGN1)
IGN2: IGN2.2 U$2.P$33(33-OUT_IGN2) U$2.P$41(41-OUT_IGN2) U$2.P$42(42-OUT_IGN2)
IGN3: IGN3.2 U$2.P$49(49-OUT_IGN3) U$2.P$50(50-OUT_IGN3) U$2.P$57(57-OUT_IGN3)
IGN4: IGN4.2 U$2.P$2(2-OUT_IGN4) U$2.P$3(3-OUT_IGN4) U$2.P$7(7-OUT_IGN4)
IGN5_FUEL: FIREWALL_M.P$56 U$2.P$16(16-OUT_IGN5) U$2.P$23(23-OUT_IGN5) U$2.P$24(24-OUT_IGN5) ; also sheet 2,6
IGN6: FIREWALL_M.P$58 SPARE_CTRL.2 U$2.P$8(8-OUT_IGN6) U$2.P$9(9-OUT_IGN6) U$2.P$15(15-OUT_IGN6) ; also sheet 2
INJ1: INJ1.1 U$2.P$65(65-OUT_INJ1)
INJ2: INJ2.1 U$2.P$34(34-OUT_INJ2)
INJ3: INJ3.1 U$2.P$51(51-OUT_INJ3)
INJ4: INJ4.1 U$2.P$43(43-OUT_INJ4)
INJ5: INJ5.1 U$2.P$25(25-OUT_INJ5)
INJ6: INJ6.1 U$2.P$64(64-OUT_INJ6)
INJ7: INJ7.1 U$2.P$59(59-OUT_INJ7)
INJ8: INJ8.1 U$2.P$58(58-OUT_INJ8)
KEY_CONTROL: CRUSC2.4 FIREWALL_M.P$62 ; also sheet 2,4,6,7
LA1_IP+: LAMBDA1.3 U$1.P$47(47-IN_LAMBDA1_IP+)
LA1_VS+: LAMBDA1.5 U$1.P$38(38-IN_LAMBDA1_VS+)
LA1_VS-: LAMBDA1.6 U$1.P$46(46-IN_LAMBDA1_VS-)
LA2_IP+: LAMBDA2.3 U$1.P$43(43-IN_LAMBDA2_IP+)
LA2_VS+: LAMBDA2.5 U$1.P$35(35-IN_LAMBDA2_VS+)
LA2_VS-: LAMBDA2.6 U$1.P$34(34-IN_LAMBDA2_VS-)
LAP_TRG: FIREWALL_M.P$43 U$1.P$15(15-IN_LAP_TRIGGER) U$3.P$45(45-IN_LAP_TRG) ; also sheet 2
LAUNCH: FIREWALL_M.P$69 GBU.P$34(34-DIG5) ; also sheet 2,6
LOAD_CELL: GBU.P$22(22-LOAD_CELL_OUT) U$2.P$19(19-IN_AN11)
MAN_MODE_GBU: FIREWALL_M.P$70 GBU.P$35(35-DIG6) ; also sheet 2,6
N$7: GBU.P$3(3-VDD_24V_1) UP_EVALVE.1
N$12: GBU.P$4(4-EVALVE_24V_OUT1) UP_EVALVE.2
N$14: DOWN_EVALVE.1 GBU.P$5(5-VDD_24V_2)
N$15: DOWN_EVALVE.2 GBU.P$6(6-EVALVE_24V_OUT2)
NEUTRAL: FIREWALL_M.P$54 GBU.P$33(33-DIG4) ; also sheet 2
OUT1_F: BARRE_FRONT.1 FIREWALL_M.P$21 ; also sheet 2
OUT1_HB1: HB1.1 U$1.P$50(50-OUT1_HB1) U$1.P$57(57-OUT1_HB1)
OUT1_HB2: HB2.1 U$1.P$65(65-OUT1_HB2) U$1.P$66(66-OUT1_HB2)
OUT1_R: BARRE_REAR.1 MOTOR_REAR.1
OUT2_F: BARRE_FRONT.2 FIREWALL_M.P$22 ; also sheet 2
OUT2_HB1: HB1.2 U$1.P$33(33-OUT2_HB1) U$1.P$42(42-OUT2_HB1)
OUT2_HB2: HB2.2 U$1.P$62(62-OUT2_HB2) U$1.P$63(63-OUT2_HB2)
OUT2_R: BARRE_REAR.2 MOTOR_REAR.2
OUT3_F: BARRE_FRONT.3 FIREWALL_M.P$23 ; also sheet 2
OUT3_R: BARRE_REAR.3 MOTOR_REAR.3
OUT4_F: BARRE_FRONT.4 FIREWALL_M.P$24 ; also sheet 2
OUT4_R: BARRE_REAR.4 MOTOR_REAR.4
OUT_LA1: LAMBDA1.1 U$2.P$1(1-OUT_LAMBDA1)
OUT_LA2: LAMBDA2.1 U$2.P$5(5-OUT_LAMBDA2)
PELV1_H2O: FIREWALL_M.P$57 U$1.P$16(16-OUT_PELV1) ; also sheet 2,6
PELV2_AIR: FIREWALL_M.P$55 U$1.P$24(24-OUT_PELV2) ; also sheet 2,6
PELV3: SPARE_CTRL.1 U$1.P$8(8-OUT_PELV3)
PELV4: SPARE_CTRL.3 U$1.P$9(9-OUT_PELV4)
PKUP1N: SMOT.2 U$2.P$14(14-IN_PKUP1N)
PKUP1P: SMOT.1 U$2.P$21(21-IN_PKUP1P)
PT1_SDL: DETACH_M.P$26 U$3.P$13(13-IN_PT1) ; also sheet 3
PT2_SDL: DETACH_M.P$25 U$3.P$14(14-IN_PT2) ; also sheet 3
PT3_SDL: DETACH_M.P$28 U$3.P$21(21-IN_PT3) ; also sheet 3
PT4_SDL: DETACH_M.P$36 U$3.P$7(7-IN_PT4) ; also sheet 3
PWM: DRS_REAR.2 DRS_SERVO.2
RX_ETH_N_SDL: FIREWALL_M.P$36 U$3.P$32(32-ETH_RXN) ; also sheet 2,5
RX_ETH_N_SRT: FIREWALL_M.P$32 U$1.P$1(1-RX_ETH_N) ; also sheet 2,5
RX_ETH_P_SDL: FIREWALL_M.P$35 U$3.P$41(41-ETH_RXP) ; also sheet 2,5
RX_ETH_P_SRT: FIREWALL_M.P$31 U$1.P$5(5-RX_ETH_P) ; also sheet 2,5
SE1_SDL: FIREWALL_M.P$14 U$3.P$63(63-IN_SE1) ; also sheet 2
SE2_SDL: FIREWALL_M.P$28 U$3.P$66(66-IN_SE2) ; also sheet 2
SE3_SDL: DETACH_M.P$3 U$3.P$62(62-IN_SE3) ; also sheet 3
SE4_SDL: DETACH_M.P$4 U$3.P$27(27-IN_SE4) ; also sheet 3
SE5_SDL: ACCELEROMETRO.2 U$3.P$4(4-IN_SE5)
SE6_SDL: ACCELEROMETRO.3 U$3.P$12(12-IN_SE6)
SE7_SDL: SUSP_RR.2 U$3.P$11(11-IN_SE7)
SE8_SDL: SUSP_RL.2 U$3.P$36(36-IN_SE8)
SE9_SDL: DETACH_M.P$5 U$3.P$26(26-IN_SE9) ; also sheet 3
SE10_SDL: DETACH_M.P$6 U$3.P$18(18-IN_SE10) ; also sheet 3
SE11_SDL: FIREWALL_M.P$25 SENSORS.3 U$3.P$6(6-IN_SE11) ; also sheet 2
SE12_SDL: BSPD1.3 CRITICAL2_BSE.1 FIREWALL_M.P$29 SENSORS.1 U$3.P$35(35-IN_SE12) ; also sheet 2
SE13_SDL: FIREWALL_M.P$30 U$3.P$52(52-IN_SE13) ; also sheet 2
SE14_SDL: DETACH_M.P$15 GYRO.5 U$3.P$53(53-IN_SE14) ; also sheet 3
SE15_SDL: DETACH_M.P$16 GYRO.4 U$3.P$44(44-IN_SE15) ; also sheet 3
SE16_SDL: DETACH_M.P$17 GYRO.3 U$3.P$10(10-IN_SE16) ; also sheet 3
SE17_SDL: DETACH_M.P$19 U$3.P$22(22-IN_DIFF1_P) ; also sheet 3
SE18_SDL: DETACH_M.P$20 U$3.P$38(38-IN_DIFF2_P) ; also sheet 3
SECURITY1: FIREWALL_M.P$67 SICUREZZA_F.1 ; also sheet 2,4
SECURITY2: CRITICAL3.3 FIREWALL_M.P$66 ; also sheet 2
SECURITY3: CRITICAL3.4 SICUREZZA_F.2 ; also sheet 4
SERVO_GND: DRS_REAR.3 DRS_SERVO.3
START: CRUSC2.5 FIREWALL_M.P$64 ; also sheet 2,4,6
TCK1N: DETACH_M.P$10 U$3.P$56(56-TCK1_N) ; also sheet 3
TCK1P: DETACH_M.P$9 U$3.P$55(55-TCK1_P) ; also sheet 3
TCK2N: DETACH_M.P$14 U$3.P$57(57-TCK2_N) ; also sheet 3
TCK2P: DETACH_M.P$13 U$3.P$49(49-TCK2_P) ; also sheet 3
TEMP1: T_H2O.1 U$2.P$22(22-IN_TEMP1)
TEMP2: MAP.2 U$2.P$31(31-IN_TEMP2)
TEMP3: T_OIL.1 U$1.P$52(52-IN_TEMP3)
TEMP4: FIREWALL_M.P$46 U$1.P$45(45-IN_TEMP4) ; also sheet 2,6
TX_ETH_N_SDL: FIREWALL_M.P$38 U$3.P$50(50-ETH_TXN) ; also sheet 2,5
TX_ETH_N_SRT: FIREWALL_M.P$34 U$1.P$10(10-TX_ETH_N) ; also sheet 2,5
TX_ETH_P_SDL: FIREWALL_M.P$37 U$3.P$42(42-ETH_TXP) ; also sheet 2,5
TX_ETH_P_SRT: FIREWALL_M.P$33 U$1.P$4(4-TX_ETH_P) ; also sheet 2,5
UPSHIFT: FIREWALL_M.P$52 GBU.P$31(31-DIG2) ; also sheet 2
VALVE3: GBU.P$9(9-EVALVE_OUT_3) GBU_SPARE1.8
VALVE4: GBU.P$10(10-EVALVE_OUT_4) GBU_SPARE1.7
VALVE5: GBU.P$11(11-EVALVE_OUT_5) GBU_SPARE1.6
VALVE6: GBU.P$12(12-EVALVE_OUT_6) GBU_SPARE1.5
VALVE7: GBU.P$13(13-EVALVE_OUT_7) GBU_SPARE1.4
VALVE8: GBU.P$14(14-EVALVE_OUT_8) GBU_SPARE1.3
VKEY: BATT_F.8 BATT_F.9 BATT_F.10 CAN_IMU.4 FIREWALL_M.P$1 IGN1.1 IGN2.1 IGN3.1 IGN4.1 INJ1.2 INJ2.2 INJ3.2 INJ4.2 INJ5.2 INJ6.2 INJ7.2 INJ8.2 LAMBDA1.2 LAMBDA2.2 U$1.P$36(36-IN_VBINJ) WS_RL.1 WS_RR.1 ; also sheet 2,4,7
VREF1_SDL: ACCELEROMETRO.1 GYRO.1 U$3.P$43(43-EXT_VREF1)
VREF1_SRT: FIREWALL_M.P$2 GEAR.2 MAP.3 P_FUEL.1 P_OIL.1 SCAM.3 TPS2.3 U$2.P$4(4-EXTVREF1) ; also sheet 2
VREF2_SDL: DETACH_M.P$34 U$3.P$51(51-EXT_VREF2) ; also sheet 3
VREF2_SRT: FIREWALL_M.P$3 TPS1.3 U$2.P$17(17-EXTVREF2) ; also sheet 2
VREF3_SDL: AIR_PRES.2 SUSP_RL.1 SUSP_RR.1 U$3.P$33(33-EXT_VREF3)
VREF3_SRT: FIREWALL_M.P$4 U$1.P$58(58-EXTVREF3) ; also sheet 2,6
VREF4_SDL: FIREWALL_M.P$5 U$3.P$16(16-EXT_VREF4) ; also sheet 2
Unconnected: DETACH_M.P$37 FIREWALL_M.P$71 FIREWALL_M.P$72 FIREWALL_M.P$73 FIREWALL_M.P$74 FIREWALL_M.P$75 FIREWALL_M.P$76 FIREWALL_M.P$77 FIREWALL_M.P$78 FIREWALL_M.P$79 GBU.P$7(7-GND_24V_1) GBU.P$8(8-GND_24V_2) GBU.P$21(21-AT_1) GBU_SPARE2.8 LAMBDA1.4 LAMBDA2.4 TPS1.1 U$1.P$11(11-IN_PKUP2P) U$1.P$12(12-IN_PKUP2_3N) U$1.P$13(13-I_O_SINCRO) U$1.P$14(14-RX) U$1.P$17(17-INP_KNOCK_2N) U$1.P$18(18-INP_KNOCK_2P) U$1.P$19(19-IN_PKUP3P) U$1.P$20(20-TX) U$1.P$25(25-INP_KNOCK_1P) U$1.P$26(26-INP_KNOCK_1N) U$1.P$39(39-IN_TC2N) U$1.P$48(48-IN_TC2P) U$1.P$49(49-IN_HALL1) U$1.P$54(54-IN_TC1N) U$1.P$61(61-IN_TC1P) U$3.P$8(8-ARC_B) U$3.P$9(9-ARC_A) U$3.P$54(54-EXT_RS232_TX) U$3.P$60(60-PICKUP-P) U$3.P$61(61-EXT_RS232_RX) U$3.P$65(65-PICKUP_N)

### Notes on the sheet
- DOVE NON SPECIFICATO
  USARE AWG22
- DOVE NON SPECIFICATO
  USARE AWG22
- CAVO SCHERMATO
- AWG20
- Filo dal TPS1 a dentro la scheda. All'interno della scheda c'è un ponte che lo collega al pin 1 del BSPD1 che realizza la serie
- Il ramo chiamato AN7_TPS1 serve 
  per portare il segnale in ECU  
  attraverso il cablaggio
- Idem per il freno
- Filo che ESCE dalla scheda e va al cruscotto
- CRITICAL BOARD
- BARRE E DRS BOARD
- DOVE NON SPECIFICATO
  USARE AWG22
- AWG20
- AWG20
- AWG20
- AWG20
- AWG20
- AWG20
- AWG20
- AWG20
- AWG20
- AWG20
- AWG20
- ANGOLO 90°
  PREFORMATO
  SI VEDA TAVOLA PER
  ANGOLO USCITA CAVO
- USCITA CABLAGGIO
- 90°
- CHIAVE CONNETTORE
- VISTA FRONTALE CONNETTORE
  LATO DEI PIN

## Sheet 2 of 7: Front Part
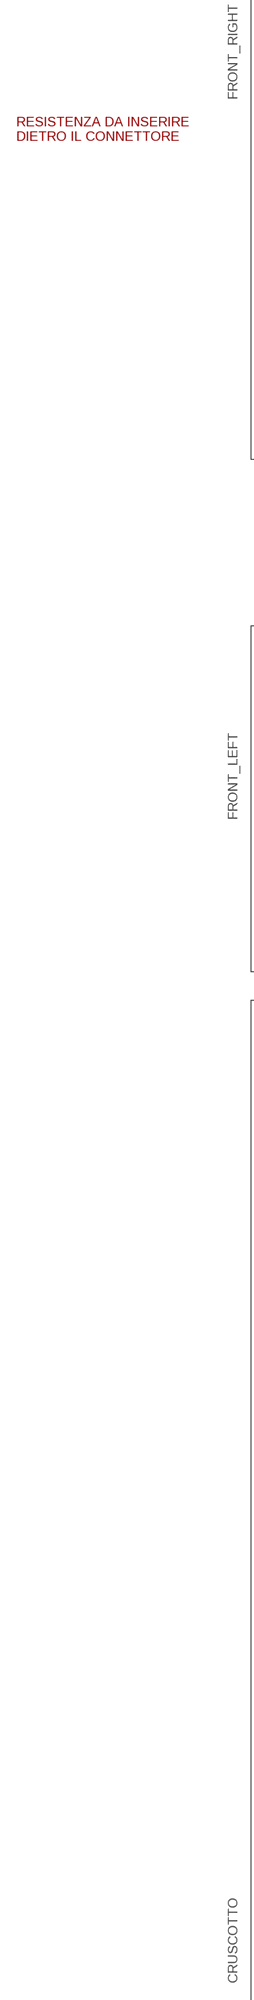
[diagram p9: schematic, sheet 2, part 1 of 3]
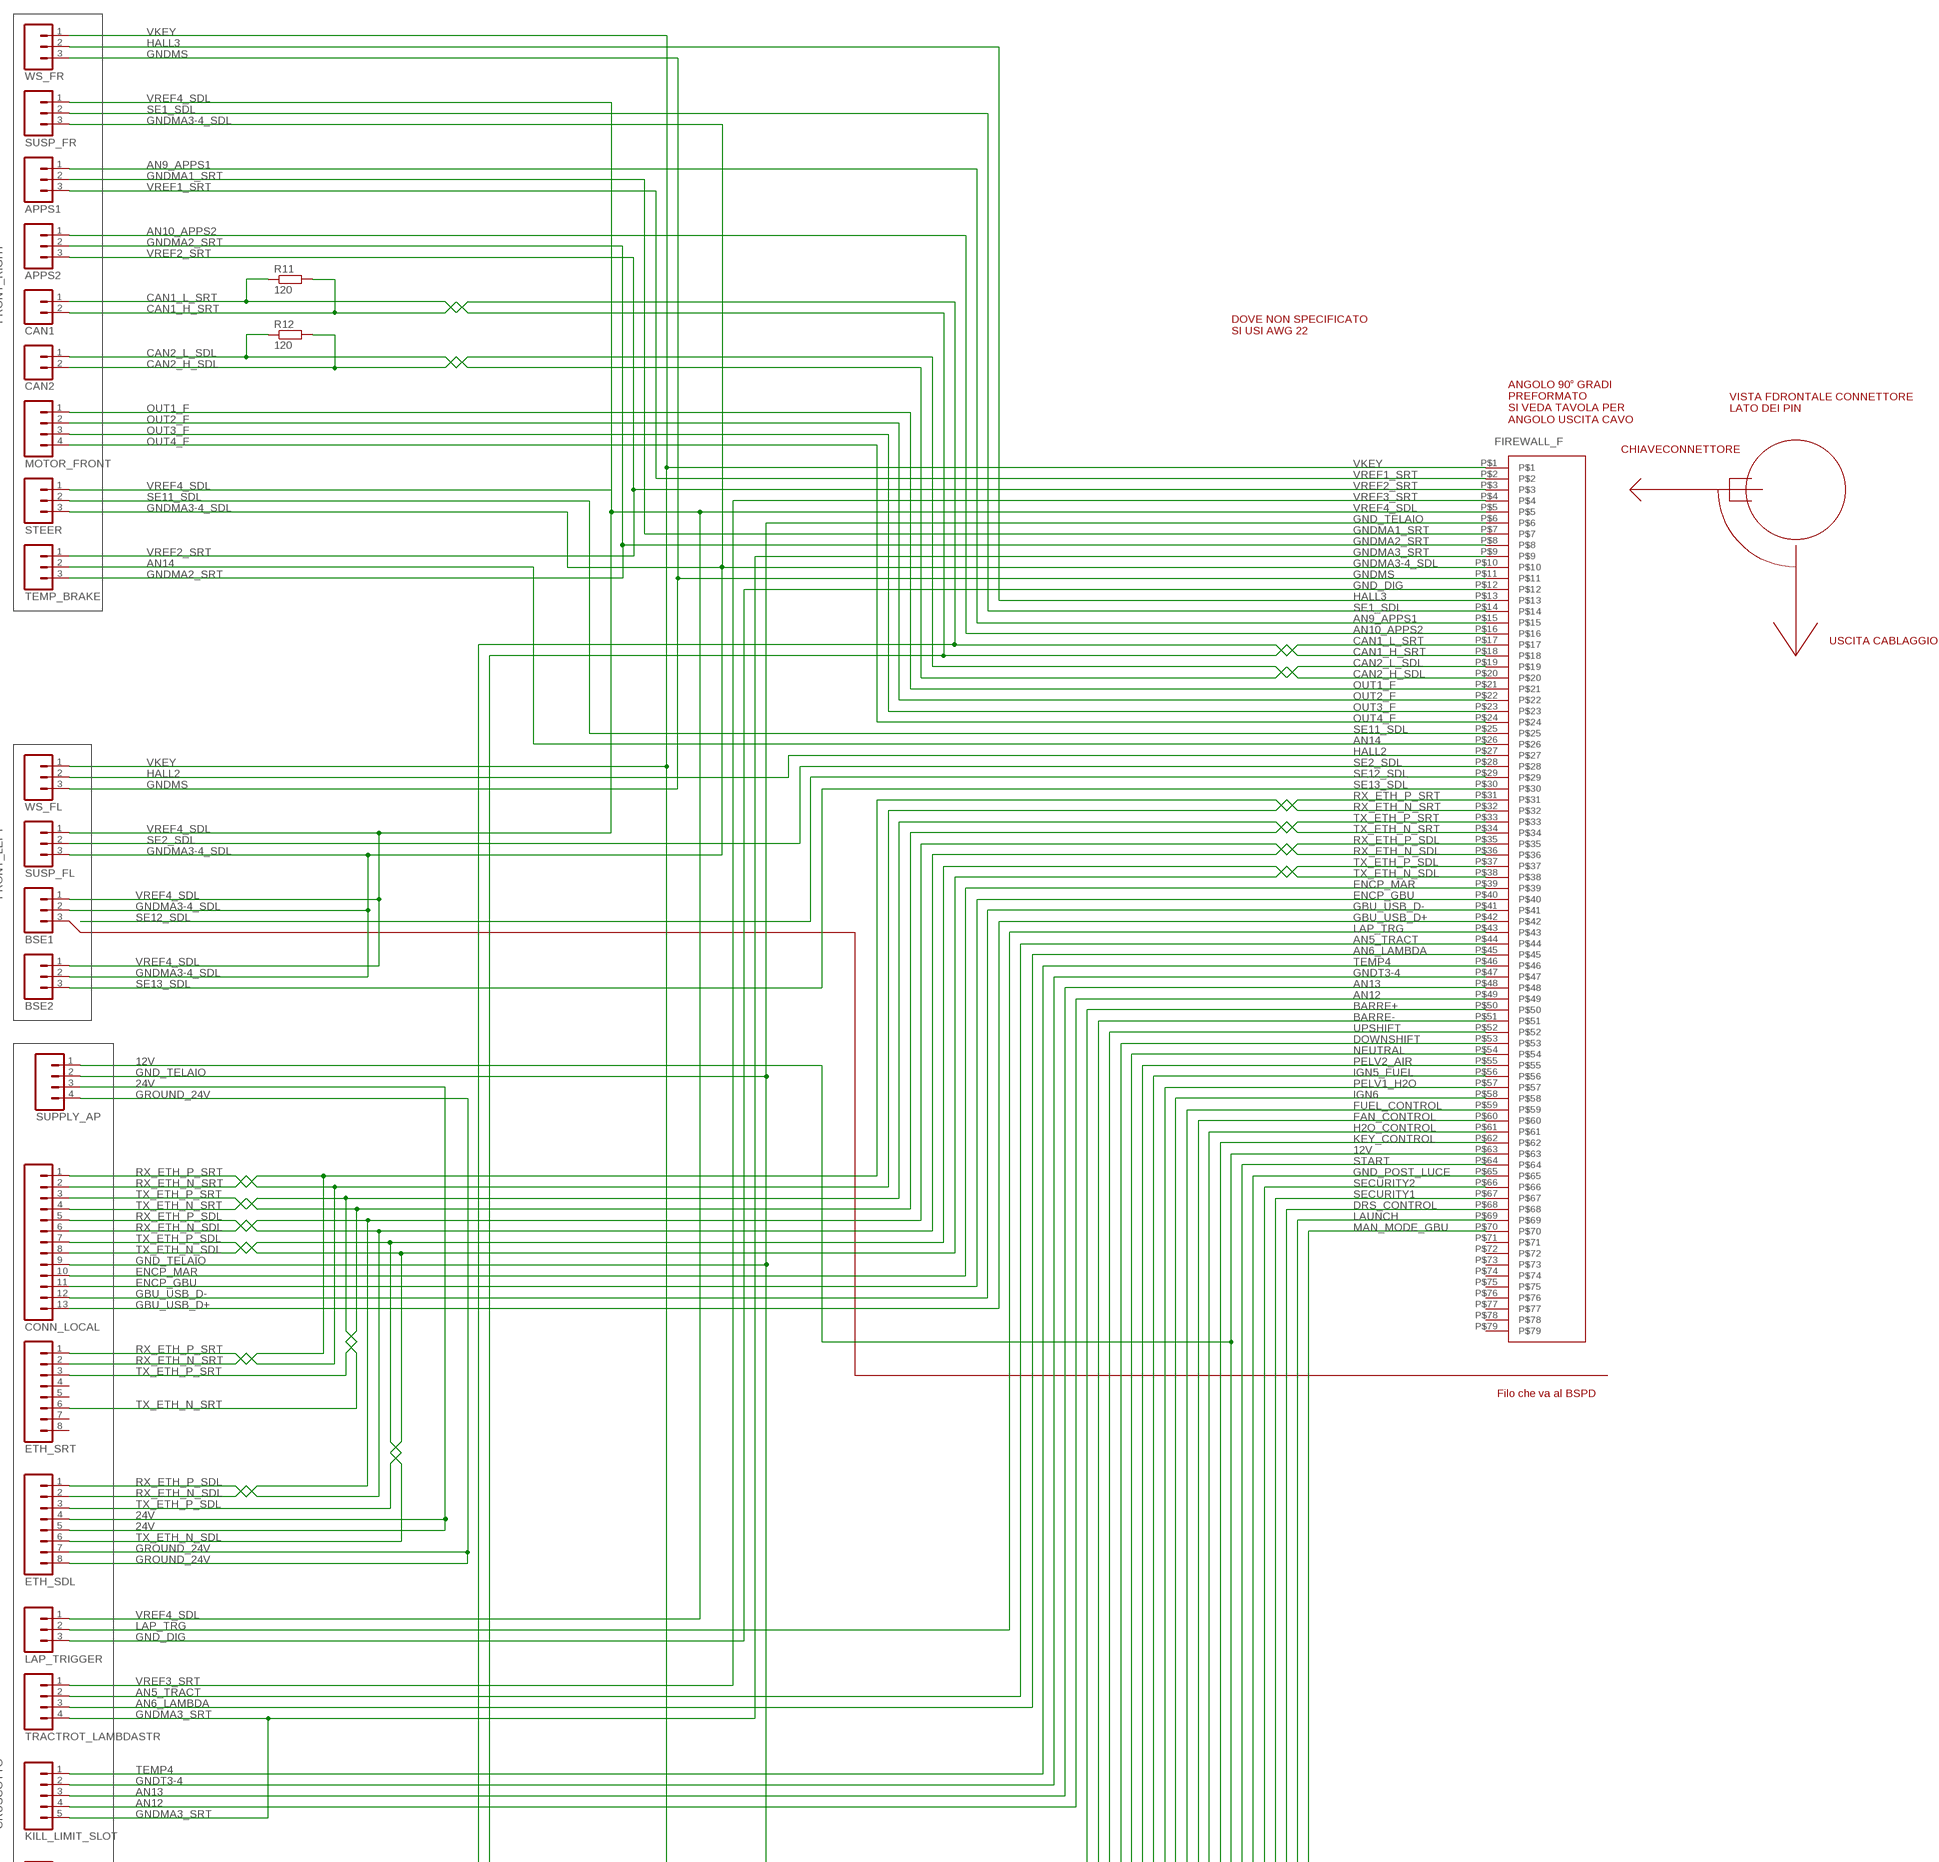
[diagram p10: schematic, sheet 2, part 2 of 3]
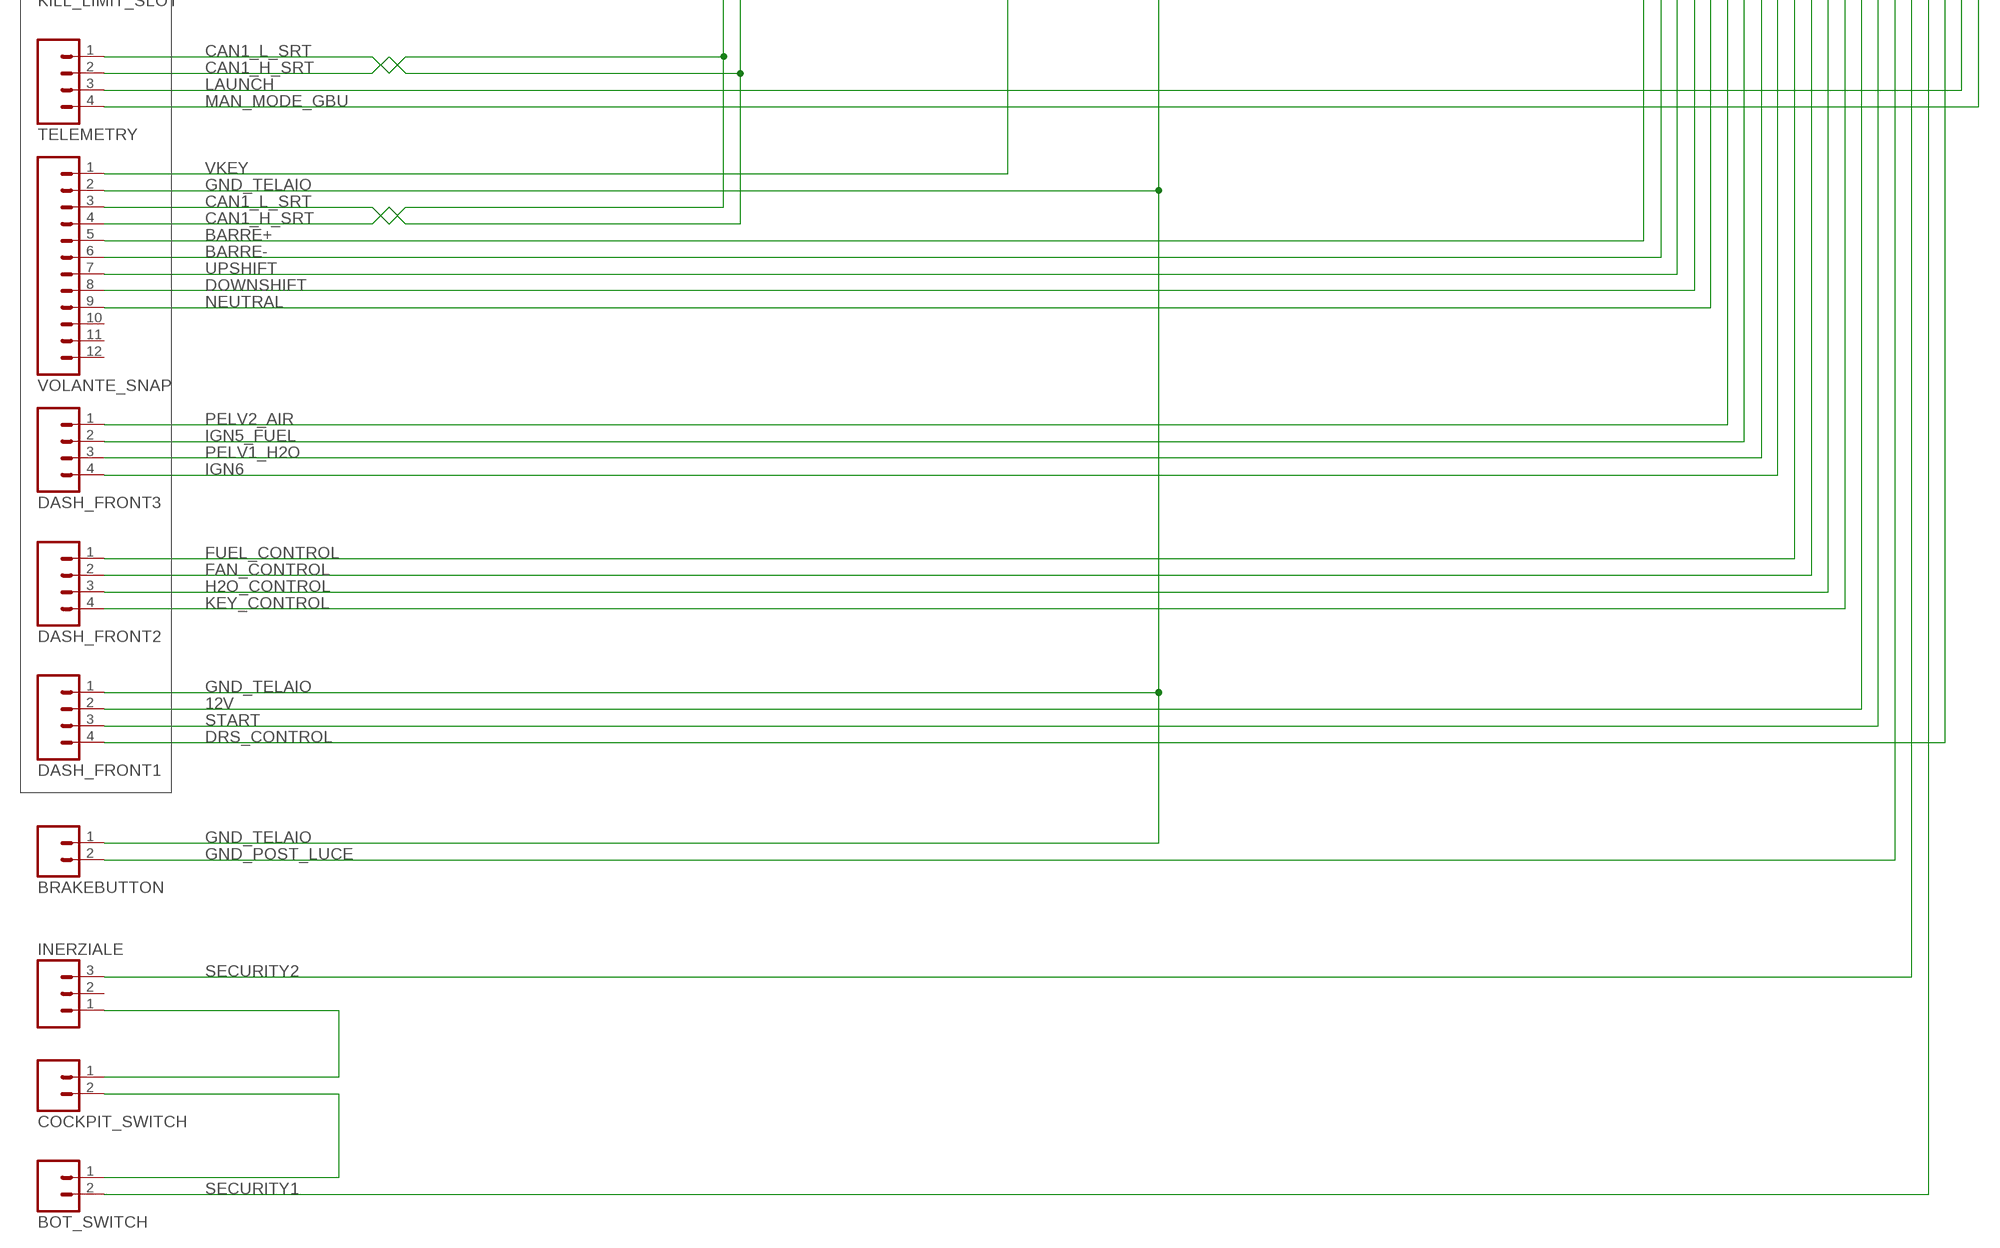
[diagram p11: schematic, sheet 2, part 3 of 3]

### Parts
APPS1  M03  [03P]
APPS2  M03  [03P]
BOT_SWITCH  M02  [02P]
BRAKEBUTTON  M02  [02P]
BSE1  M03  [03P]
BSE2  M03  [03P]
CAN1  M02  [02P]
CAN2  M02  [02P]
COCKPIT_SWITCH  M02  [02P]
CONN_LOCAL  M13  [13P]
DASH_FRONT1  M04  [04P]
DASH_FRONT2  M04  [04P]
DASH_FRONT3  M04  [04P]
ETH_SDL  M08  [08P]
ETH_SRT  M08  [08P]
FIREWALL_F  79PIN_CONNECTOR  [NONE]
INERZIALE  M03  [03P]
KILL_LIMIT_SLOT  M05  [05P]
LAP_TRIGGER  M03  [03P]
MOTOR_FRONT  M04  [04P]
R11  120  R-EU_0204/2V  [0204V]
R12  120  R-EU_0204/2V  [0204V]
STEER  M03  [03P]
SUPPLY_AP  M04  [04P]
SUSP_FL  M03  [03P]
SUSP_FR  M03  [03P]
TELEMETRY  M04  [04P]
TEMP_BRAKE  M03  [03P]
TRACTROT_LAMBDASTR  M04  [04P]
VOLANTE_SNAP  M12  [12P]
WS_FL  M03  [03P]
WS_FR  M03  [03P]

### Nets
12V: DASH_FRONT1.2 FIREWALL_F.P$63 SUPPLY_AP.1 ; also sheet 1,3,4,6,7
24V: ETH_SDL.4 ETH_SDL.5 SUPPLY_AP.3
AN5_TRACT: FIREWALL_F.P$44 TRACTROT_LAMBDASTR.2 ; also sheet 1,6
AN6_LAMBDA: FIREWALL_F.P$45 TRACTROT_LAMBDASTR.3 ; also sheet 1,6
AN9_APPS1: APPS1.1 FIREWALL_F.P$15 ; also sheet 1
AN10_APPS2: APPS2.1 FIREWALL_F.P$16 ; also sheet 1
AN12: FIREWALL_F.P$49 KILL_LIMIT_SLOT.4 ; also sheet 1,6
AN13: FIREWALL_F.P$48 KILL_LIMIT_SLOT.3 ; also sheet 1,6
AN14: FIREWALL_F.P$26 TEMP_BRAKE.2 ; also sheet 1
BARRE+: FIREWALL_F.P$50 VOLANTE_SNAP.5 ; also sheet 1
BARRE-: FIREWALL_F.P$51 VOLANTE_SNAP.6 ; also sheet 1
CAN1_H_SRT: CAN1.2 FIREWALL_F.P$18 R11.2 TELEMETRY.2 VOLANTE_SNAP.4 ; also sheet 1,3,6
CAN1_L_SRT: CAN1.1 FIREWALL_F.P$17 R11.1 TELEMETRY.1 VOLANTE_SNAP.3 ; also sheet 1,3,6
CAN2_H_SDL: CAN2.2 FIREWALL_F.P$20 R12.2 ; also sheet 1,3
CAN2_L_SDL: CAN2.1 FIREWALL_F.P$19 R12.1 ; also sheet 1,3
DOWNSHIFT: FIREWALL_F.P$53 VOLANTE_SNAP.8 ; also sheet 1
DRS_CONTROL: DASH_FRONT1.4 FIREWALL_F.P$68 ; also sheet 1,6
ENCP_GBU: CONN_LOCAL.11 FIREWALL_F.P$40 ; also sheet 1,5
ENCP_MAR: CONN_LOCAL.10 FIREWALL_F.P$39 ; also sheet 1,5
FAN_CONTROL: DASH_FRONT2.2 FIREWALL_F.P$60 ; also sheet 1,4,6,7
FUEL_CONTROL: DASH_FRONT2.1 FIREWALL_F.P$59 ; also sheet 1,4,6,7
GBU_USB_D+: CONN_LOCAL.13 FIREWALL_F.P$42 ; also sheet 1,5
GBU_USB_D-: CONN_LOCAL.12 FIREWALL_F.P$41 ; also sheet 1,5
GND_DIG: FIREWALL_F.P$12 LAP_TRIGGER.3 ; also sheet 1
GND_POST_LUCE: BRAKEBUTTON.2 FIREWALL_F.P$65 ; also sheet 1,4
GND_TELAIO: BRAKEBUTTON.1 CONN_LOCAL.9 DASH_FRONT1.1 FIREWALL_F.P$6 SUPPLY_AP.2 VOLANTE_SNAP.2 ; also sheet 1,3,4,5,6
GNDMA1_SRT: APPS1.2 FIREWALL_F.P$7
GNDMA2_SRT: APPS2.2 FIREWALL_F.P$8 TEMP_BRAKE.3
GNDMA3-4_SDL: BSE1.2 BSE2.2 FIREWALL_F.P$10 STEER.3 SUSP_FL.3 SUSP_FR.3 ; also sheet 1
GNDMA3_SRT: FIREWALL_F.P$9 KILL_LIMIT_SLOT.5 TRACTROT_LAMBDASTR.4
GNDMS: FIREWALL_F.P$11 WS_FL.3 WS_FR.3 ; also sheet 1
GNDT3-4: FIREWALL_F.P$47 KILL_LIMIT_SLOT.2 ; also sheet 1,6
GROUND_24V: ETH_SDL.7 ETH_SDL.8 SUPPLY_AP.4
H2O_CONTROL: DASH_FRONT2.3 FIREWALL_F.P$61 ; also sheet 1,6,7
HALL2: FIREWALL_F.P$27 WS_FL.2 ; also sheet 1
HALL3: FIREWALL_F.P$13 WS_FR.2 ; also sheet 1
IGN5_FUEL: DASH_FRONT3.2 FIREWALL_F.P$56 ; also sheet 1,6
IGN6: DASH_FRONT3.4 FIREWALL_F.P$58 ; also sheet 1
KEY_CONTROL: DASH_FRONT2.4 FIREWALL_F.P$62 ; also sheet 1,4,6,7
LAP_TRG: FIREWALL_F.P$43 LAP_TRIGGER.2 ; also sheet 1
LAUNCH: FIREWALL_F.P$69 TELEMETRY.3 ; also sheet 1,6
MAN_MODE_GBU: FIREWALL_F.P$70 TELEMETRY.4 ; also sheet 1,6
N$25: COCKPIT_SWITCH.1 INERZIALE.1
N$26: BOT_SWITCH.1 COCKPIT_SWITCH.2
NEUTRAL: FIREWALL_F.P$54 VOLANTE_SNAP.9 ; also sheet 1
OUT1_F: FIREWALL_F.P$21 MOTOR_FRONT.1 ; also sheet 1
OUT2_F: FIREWALL_F.P$22 MOTOR_FRONT.2 ; also sheet 1
OUT3_F: FIREWALL_F.P$23 MOTOR_FRONT.3 ; also sheet 1
OUT4_F: FIREWALL_F.P$24 MOTOR_FRONT.4 ; also sheet 1
PELV1_H2O: DASH_FRONT3.3 FIREWALL_F.P$57 ; also sheet 1,6
PELV2_AIR: DASH_FRONT3.1 FIREWALL_F.P$55 ; also sheet 1,6
RX_ETH_N_SDL: CONN_LOCAL.6 ETH_SDL.2 FIREWALL_F.P$36 ; also sheet 1,5
RX_ETH_N_SRT: CONN_LOCAL.2 ETH_SRT.2 FIREWALL_F.P$32 ; also sheet 1,5
RX_ETH_P_SDL: CONN_LOCAL.5 ETH_SDL.1 FIREWALL_F.P$35 ; also sheet 1,5
RX_ETH_P_SRT: CONN_LOCAL.1 ETH_SRT.1 FIREWALL_F.P$31 ; also sheet 1,5
SE1_SDL: FIREWALL_F.P$14 SUSP_FR.2 ; also sheet 1
SE2_SDL: FIREWALL_F.P$28 SUSP_FL.2 ; also sheet 1
SE11_SDL: FIREWALL_F.P$25 STEER.2 ; also sheet 1
SE12_SDL: FIREWALL_F.P$29 ; also sheet 1
SE13_SDL: BSE2.3 FIREWALL_F.P$30 ; also sheet 1
SECURITY1: BOT_SWITCH.2 FIREWALL_F.P$67 ; also sheet 1,4
SECURITY2: FIREWALL_F.P$66 INERZIALE.3 ; also sheet 1
START: DASH_FRONT1.3 FIREWALL_F.P$64 ; also sheet 1,4,6
TEMP4: FIREWALL_F.P$46 KILL_LIMIT_SLOT.1 ; also sheet 1,6
TX_ETH_N_SDL: CONN_LOCAL.8 ETH_SDL.6 FIREWALL_F.P$38 ; also sheet 1,5
TX_ETH_N_SRT: CONN_LOCAL.4 ETH_SRT.6 FIREWALL_F.P$34 ; also sheet 1,5
TX_ETH_P_SDL: CONN_LOCAL.7 ETH_SDL.3 FIREWALL_F.P$37 ; also sheet 1,5
TX_ETH_P_SRT: CONN_LOCAL.3 ETH_SRT.3 FIREWALL_F.P$33 ; also sheet 1,5
UPSHIFT: FIREWALL_F.P$52 VOLANTE_SNAP.7 ; also sheet 1
VKEY: FIREWALL_F.P$1 VOLANTE_SNAP.1 WS_FL.1 WS_FR.1 ; also sheet 1,4,7
VREF1_SRT: APPS1.3 FIREWALL_F.P$2 ; also sheet 1
VREF2_SRT: APPS2.3 FIREWALL_F.P$3 TEMP_BRAKE.1 ; also sheet 1
VREF3_SRT: FIREWALL_F.P$4 TRACTROT_LAMBDASTR.1 ; also sheet 1,6
VREF4_SDL: BSE1.1 BSE2.1 FIREWALL_F.P$5 LAP_TRIGGER.1 STEER.1 SUSP_FL.1 SUSP_FR.1 ; also sheet 1
Unconnected: BSE1.3 ETH_SRT.4 ETH_SRT.5 ETH_SRT.7 ETH_SRT.8 FIREWALL_F.P$71 FIREWALL_F.P$72 FIREWALL_F.P$73 FIREWALL_F.P$74 FIREWALL_F.P$75 FIREWALL_F.P$76 FIREWALL_F.P$77 FIREWALL_F.P$78 FIREWALL_F.P$79 INERZIALE.2 VOLANTE_SNAP.10 VOLANTE_SNAP.11 VOLANTE_SNAP.12

### Notes on the sheet
- FRONT_RIGHT
- DOVE NON SPECIFICATO
  SI USI AWG 22
- RESISTENZA DA INSERIRE 
  DIETRO IL CONNETTORE
- VISTA FDRONTALE CONNETTORE 
  LATO DEI PIN
- ANGOLO 90° GRADI
  PREFORMATO
  SI VEDA TAVOLA PER
  ANGOLO USCITA CAVO
- CHIAVECONNETTORE
- USCITA CABLAGGIO
- FRONT_LEFT
- Filo che va al BSPD
- CRUSCOTTO

## Sheet 3 of 7: DETACH Connettore per sensori da usare per test
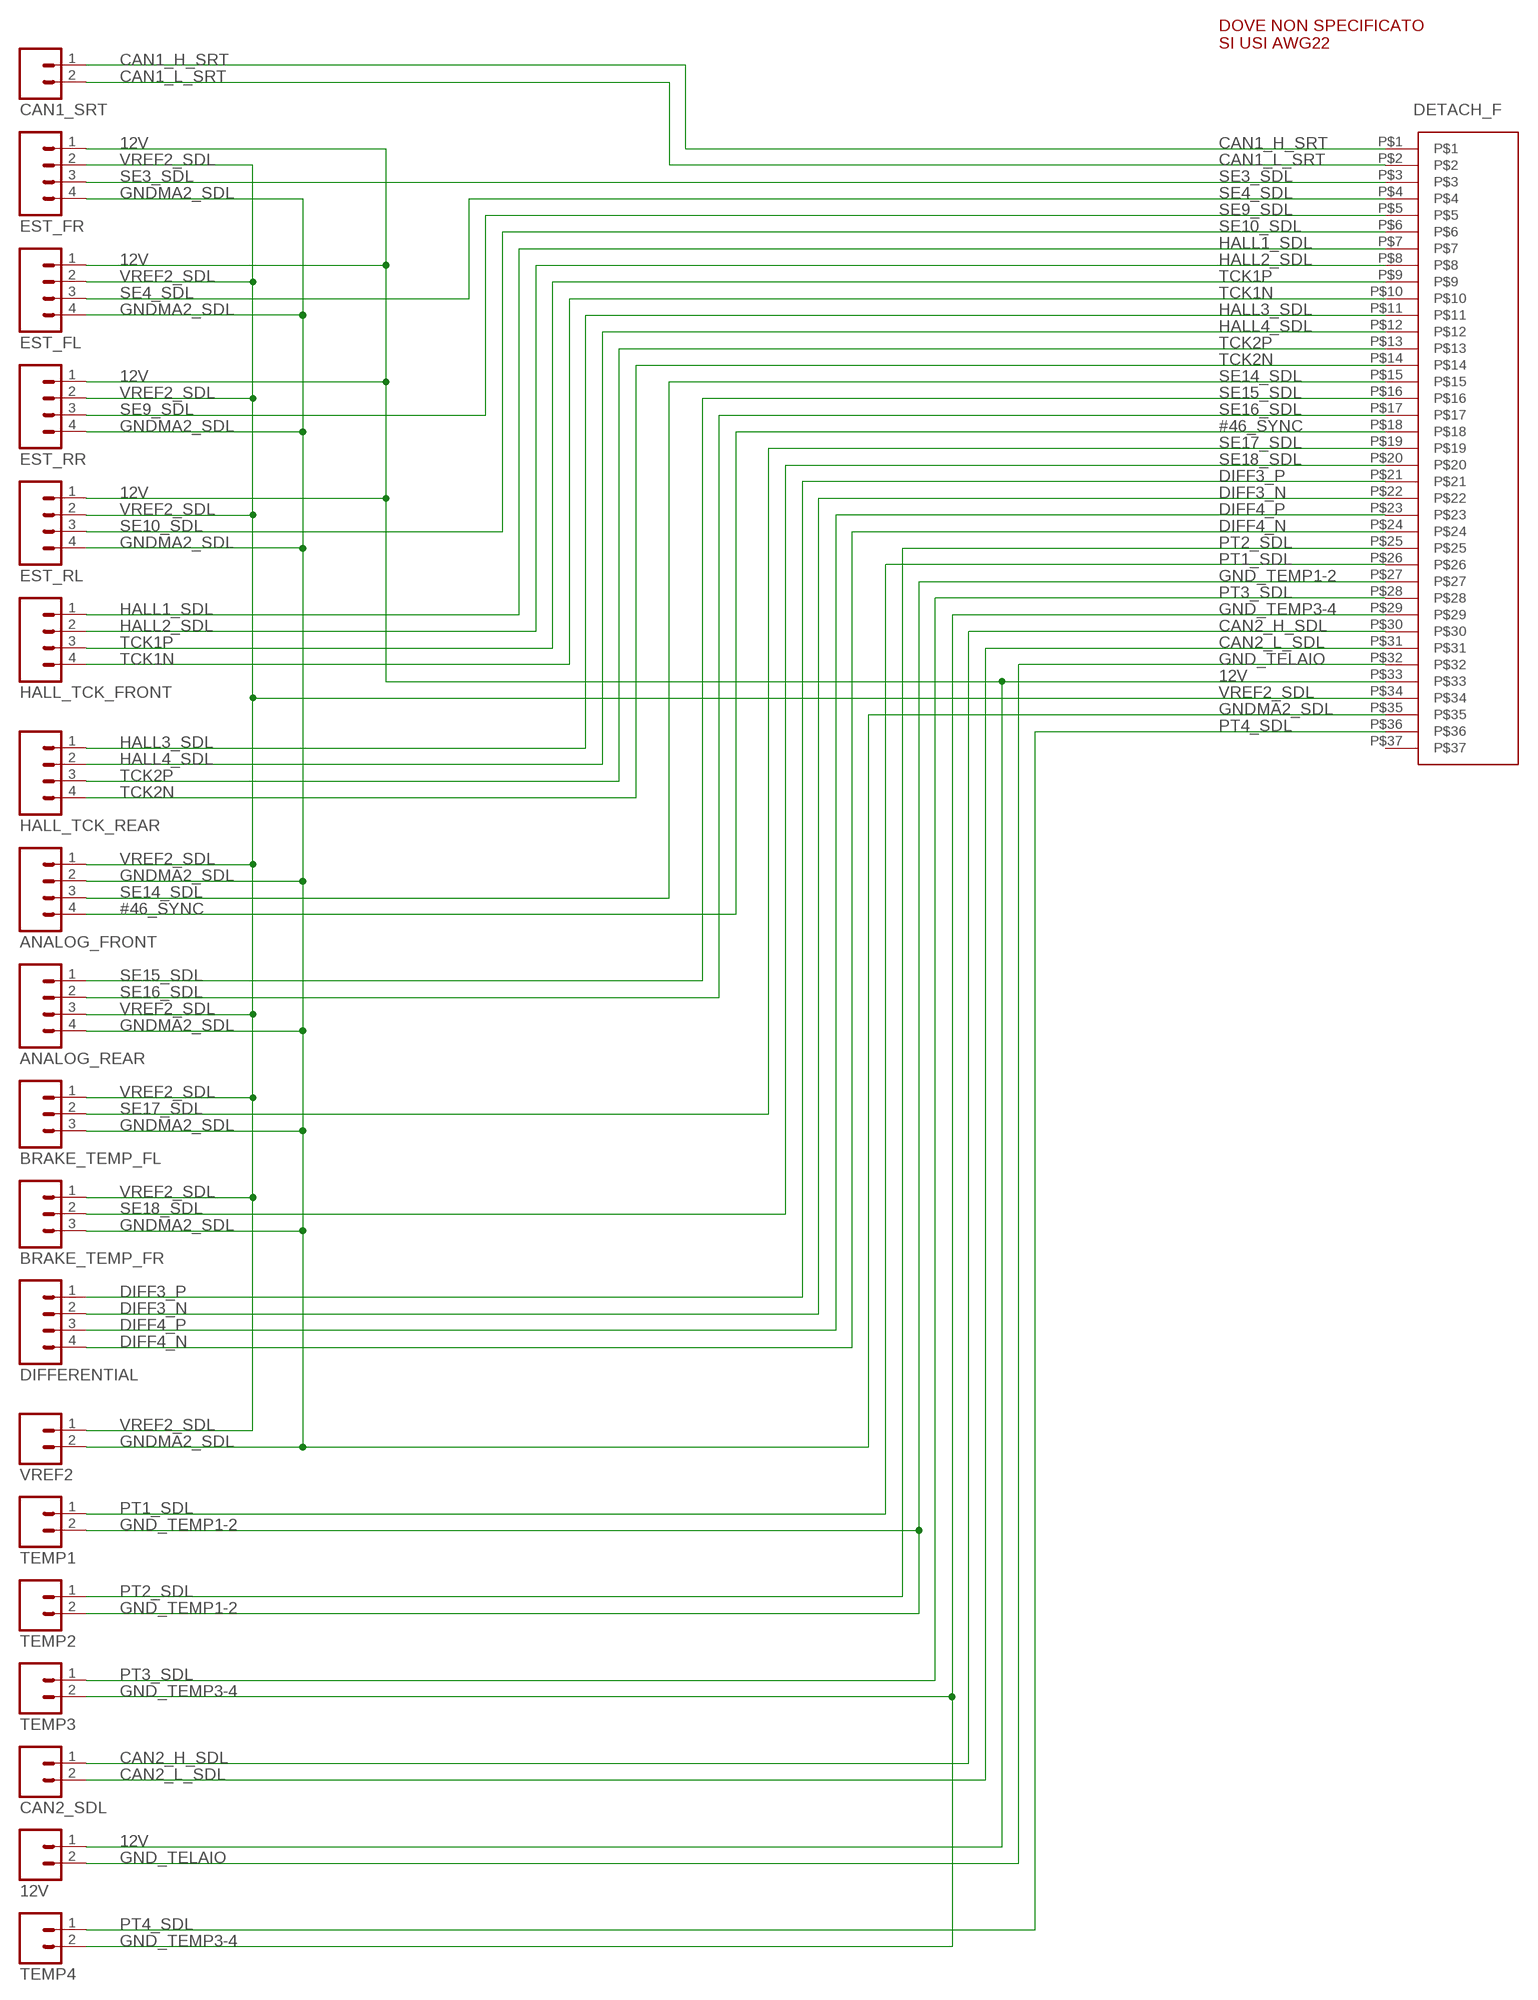
[diagram p12: schematic, sheet 3]

### Parts
12V  M02  [02P]
ANALOG_FRONT  M04  [04P]
ANALOG_REAR  M04  [04P]
BRAKE_TEMP_FL  M03  [03P]
BRAKE_TEMP_FR  M03  [03P]
CAN1_SRT  M02  [02P]
CAN2_SDL  M02  [02P]
DETACH_F  37PIN_CONNECTPR  [NONE]
DIFFERENTIAL  M04  [04P]
EST_FL  M04  [04P]
EST_FR  M04  [04P]
EST_RL  M04  [04P]
EST_RR  M04  [04P]
HALL_TCK_FRONT  M04  [04P]
HALL_TCK_REAR  M04  [04P]
TEMP1  M02  [02P]
TEMP2  M02  [02P]
TEMP3  M02  [02P]
TEMP4  M02  [02P]
VREF2  M02  [02P]

### Nets
12V: 12V.1 DETACH_F.P$33 EST_FL.1 EST_FR.1 EST_RL.1 EST_RR.1 ; also sheet 1,2,4,6,7
#46_SYNC: ANALOG_FRONT.4 DETACH_F.P$18 ; also sheet 1
CAN1_H_SRT: CAN1_SRT.1 DETACH_F.P$1 ; also sheet 1,2,6
CAN1_L_SRT: CAN1_SRT.2 DETACH_F.P$2 ; also sheet 1,2,6
CAN2_H_SDL: CAN2_SDL.1 DETACH_F.P$30 ; also sheet 1,2
CAN2_L_SDL: CAN2_SDL.2 DETACH_F.P$31 ; also sheet 1,2
DIFF3_N: DETACH_F.P$22 DIFFERENTIAL.2 ; also sheet 1
DIFF3_P: DETACH_F.P$21 DIFFERENTIAL.1 ; also sheet 1
DIFF4_N: DETACH_F.P$24 DIFFERENTIAL.4 ; also sheet 1
DIFF4_P: DETACH_F.P$23 DIFFERENTIAL.3 ; also sheet 1
GND_TELAIO: 12V.2 DETACH_F.P$32 ; also sheet 1,2,4,5,6
GND_TEMP1-2: DETACH_F.P$27 TEMP1.2 TEMP2.2 ; also sheet 1
GND_TEMP3-4: DETACH_F.P$29 TEMP3.2 TEMP4.2 ; also sheet 1
GNDMA2_SDL: ANALOG_FRONT.2 ANALOG_REAR.4 BRAKE_TEMP_FL.3 BRAKE_TEMP_FR.3 DETACH_F.P$35 EST_FL.4 EST_FR.4 EST_RL.4 EST_RR.4 VREF2.2 ; also sheet 1
HALL1_SDL: DETACH_F.P$7 HALL_TCK_FRONT.1 ; also sheet 1
HALL2_SDL: DETACH_F.P$8 HALL_TCK_FRONT.2 ; also sheet 1
HALL3_SDL: DETACH_F.P$11 HALL_TCK_REAR.1 ; also sheet 1
HALL4_SDL: DETACH_F.P$12 HALL_TCK_REAR.2 ; also sheet 1
PT1_SDL: DETACH_F.P$26 TEMP1.1 ; also sheet 1
PT2_SDL: DETACH_F.P$25 TEMP2.1 ; also sheet 1
PT3_SDL: DETACH_F.P$28 TEMP3.1 ; also sheet 1
PT4_SDL: DETACH_F.P$36 TEMP4.1 ; also sheet 1
SE3_SDL: DETACH_F.P$3 EST_FR.3 ; also sheet 1
SE4_SDL: DETACH_F.P$4 EST_FL.3 ; also sheet 1
SE9_SDL: DETACH_F.P$5 EST_RR.3 ; also sheet 1
SE10_SDL: DETACH_F.P$6 EST_RL.3 ; also sheet 1
SE14_SDL: ANALOG_FRONT.3 DETACH_F.P$15 ; also sheet 1
SE15_SDL: ANALOG_REAR.1 DETACH_F.P$16 ; also sheet 1
SE16_SDL: ANALOG_REAR.2 DETACH_F.P$17 ; also sheet 1
SE17_SDL: BRAKE_TEMP_FL.2 DETACH_F.P$19 ; also sheet 1
SE18_SDL: BRAKE_TEMP_FR.2 DETACH_F.P$20 ; also sheet 1
TCK1N: DETACH_F.P$10 HALL_TCK_FRONT.4 ; also sheet 1
TCK1P: DETACH_F.P$9 HALL_TCK_FRONT.3 ; also sheet 1
TCK2N: DETACH_F.P$14 HALL_TCK_REAR.4 ; also sheet 1
TCK2P: DETACH_F.P$13 HALL_TCK_REAR.3 ; also sheet 1
VREF2_SDL: ANALOG_FRONT.1 ANALOG_REAR.3 BRAKE_TEMP_FL.1 BRAKE_TEMP_FR.1 DETACH_F.P$34 EST_FL.2 EST_FR.2 EST_RL.2 EST_RR.2 VREF2.1 ; also sheet 1
Unconnected: DETACH_F.P$37

### Notes on the sheet
- DOVE NON SPECIFICATO
  SI USI AWG22

## Sheet 4 of 7: Alimentazione
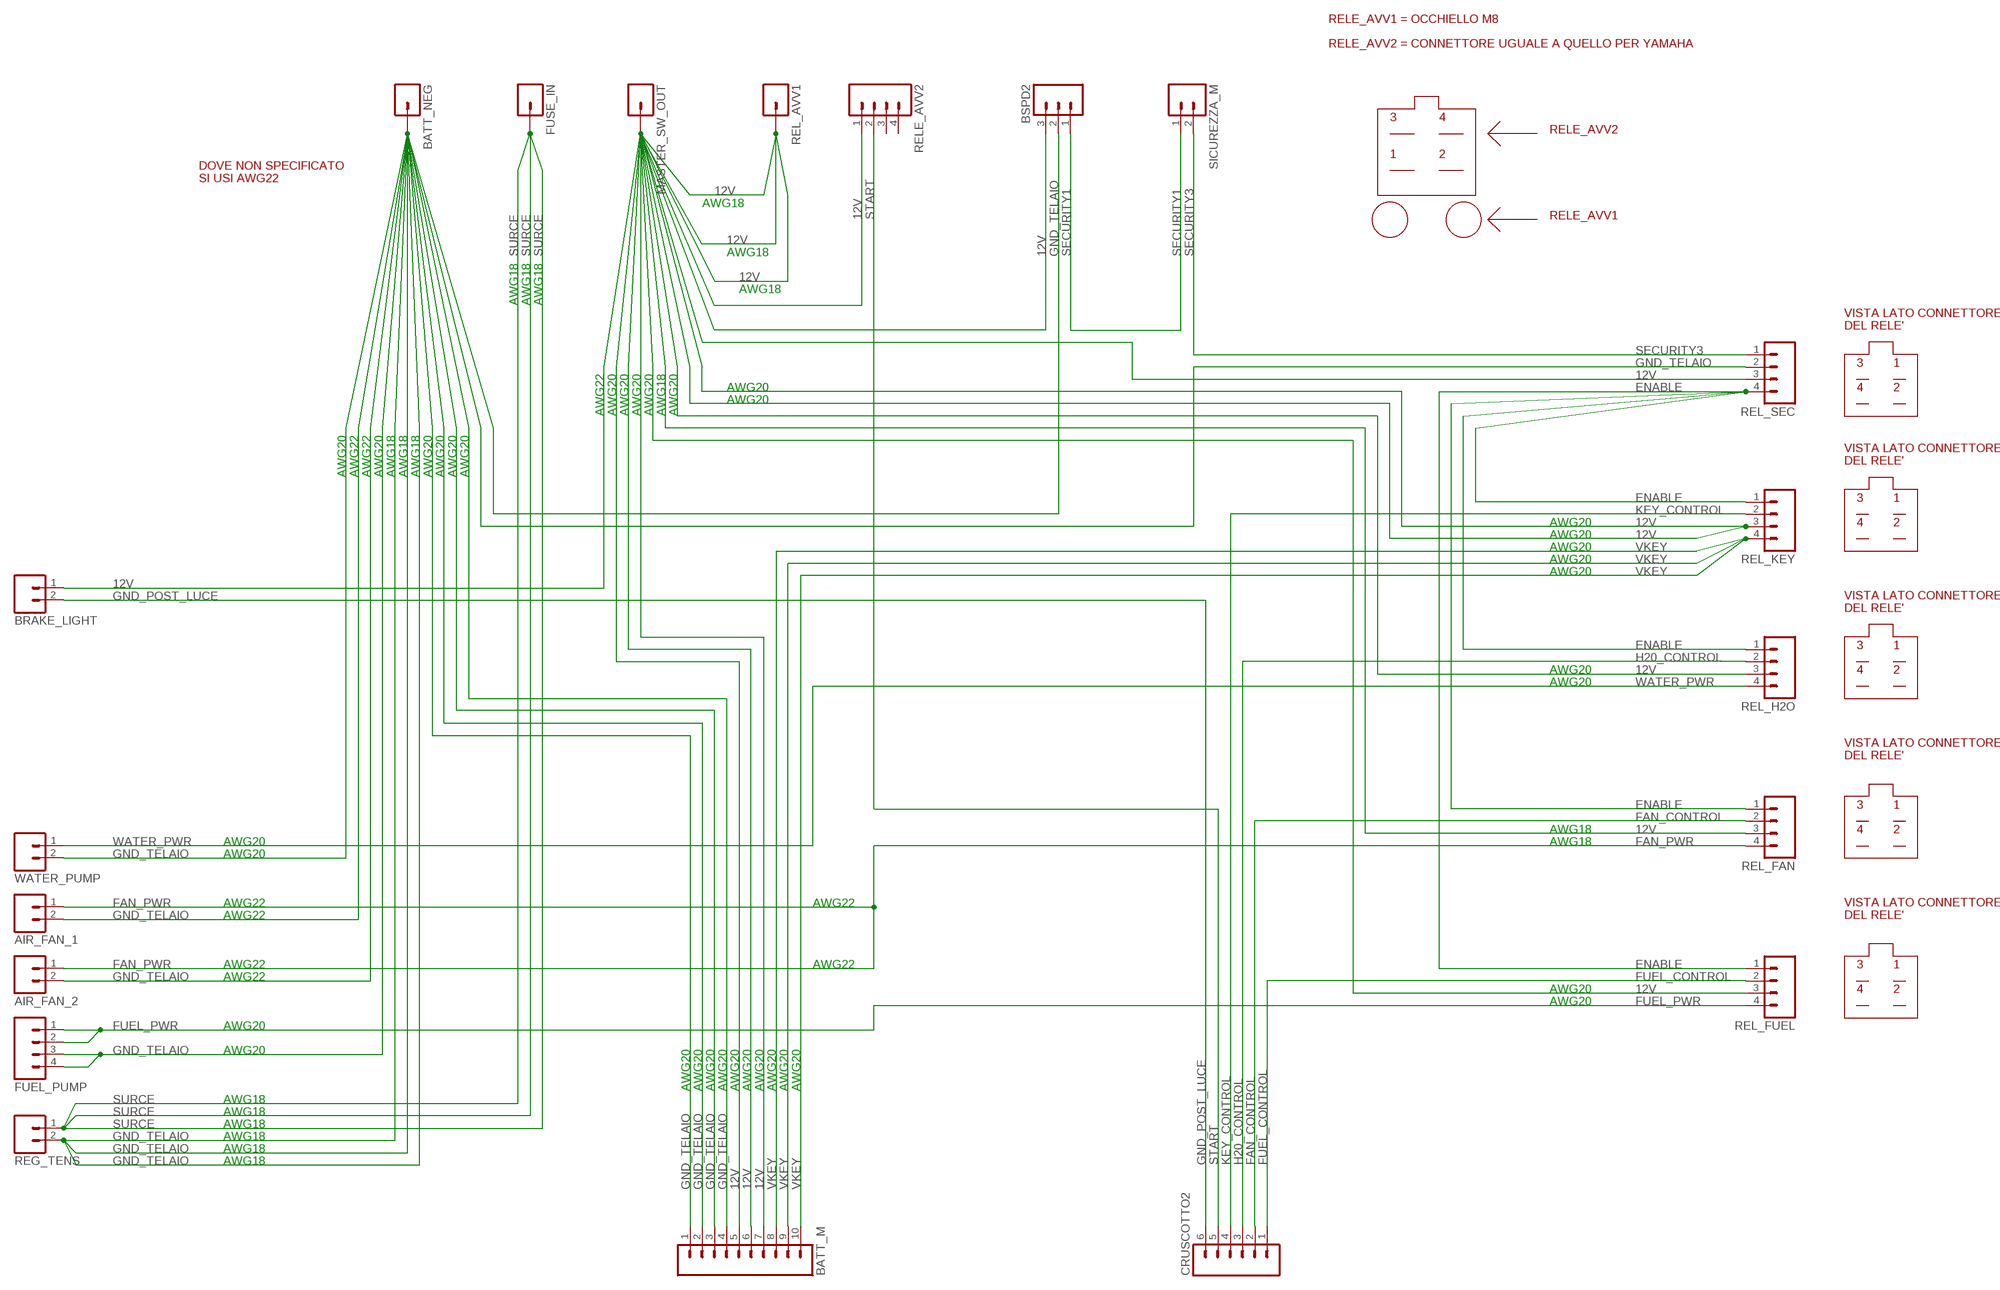
[diagram p13: schematic, sheet 4]

### Parts
AIR_FAN_1  M02  [02P]
AIR_FAN_2  M02  [02P]
BATT_M  M10  [10P]
BATT_NEG  M01PTH  [1X01@1]
BRAKE_LIGHT  M02  [02P]
BSPD2  M03  [03P]
CRUSCOTTO2  M06  [06P]
FUEL_PUMP  M04  [04P]
FUSE_IN  M01PTH  [1X01@1]
MASTER_SW_OUT  M01PTH  [1X01@1]
REG_TENS  M02  [02P]
REL_AVV1  M01PTH  [1X01@1]
REL_FAN  M04  [04P]
REL_FUEL  M04  [04P]
REL_H2O  M04  [04P]
REL_KEY  M04  [04P]
REL_SEC  M04  [04P]
RELE_AVV2  M04  [04P]
SICUREZZA_M  M02  [02P]
WATER_PUMP  M02  [02P]

### Nets
12V: BATT_M.5 BATT_M.6 BATT_M.7 BRAKE_LIGHT.1 BSPD2.3 MASTER_SW_OUT.1 REL_AVV1.1 REL_FAN.3 REL_FUEL.3 REL_H2O.3 REL_KEY.3 REL_SEC.3 RELE_AVV2.1 ; also sheet 1,2,3,6,7
ENABLE: REL_FAN.1 REL_FUEL.1 REL_H2O.1 REL_KEY.1 REL_SEC.4
FAN_CONTROL: CRUSCOTTO2.2 REL_FAN.2 ; also sheet 1,2,6,7
FAN_PWR: AIR_FAN_1.1 AIR_FAN_2.1 REL_FAN.4
FUEL_CONTROL: CRUSCOTTO2.1 REL_FUEL.2 ; also sheet 1,2,6,7
FUEL_PWR: FUEL_PUMP.1 FUEL_PUMP.2 REL_FUEL.4
GND_POST_LUCE: BRAKE_LIGHT.2 CRUSCOTTO2.6 ; also sheet 1,2
GND_TELAIO: AIR_FAN_1.2 AIR_FAN_2.2 BATT_M.1 BATT_M.2 BATT_M.3 BATT_M.4 BATT_NEG.1 BSPD2.2 FUEL_PUMP.3 FUEL_PUMP.4 REG_TENS.2 REL_SEC.2 WATER_PUMP.2 ; also sheet 1,2,3,5,6
H20_CONTROL: CRUSCOTTO2.3 REL_H2O.2
KEY_CONTROL: CRUSCOTTO2.4 REL_KEY.2 ; also sheet 1,2,6,7
SECURITY1: BSPD2.1 SICUREZZA_M.1 ; also sheet 1,2
SECURITY3: REL_SEC.1 SICUREZZA_M.2 ; also sheet 1
START: CRUSCOTTO2.5 RELE_AVV2.2 ; also sheet 1,2,6
SURCE: FUSE_IN.1 REG_TENS.1
VKEY: BATT_M.8 BATT_M.9 BATT_M.10 REL_KEY.4 ; also sheet 1,2,7
WATER_PWR: REL_H2O.4 WATER_PUMP.1
Unconnected: RELE_AVV2.3 RELE_AVV2.4

### Notes on the sheet
- RELE_AVV1 = OCCHIELLO M8
- RELE_AVV2 = CONNETTORE UGUALE A QUELLO PER YAMAHA
- 3 | 4
- RELE_AVV2
- 1 | 2
- DOVE NON SPECIFICATO
  SI USI AWG22
- AWG18
- RELE_AVV1
- AWG18
- AWG18
- AWG18 | AWG18 | AWG18
- VISTA LATO CONNETTORE
  DEL RELE'
- 3 | 1
- AWG20 | 4 | 2
- AWG20
- AWG22 | AWG20 | AWG20 | AWG20 | AWG20 | AWG18 | AWG20
- VISTA LATO CONNETTORE
  DEL RELE'
- AWG20 | AWG22 | AWG22 | AWG20 | AWG18 | AWG18 | AWG18 | AWG20 | AWG20 | AWG20 | AWG20
- 3 | 1
- AWG20 | 4 | 2
- AWG20
- AWG20
- AWG20
- AWG20
- VISTA LATO CONNETTORE
  DEL RELE'
- 3 | 1
- AWG20 | 4 | 2
- AWG20
- VISTA LATO CONNETTORE
  DEL RELE'
- 3 | 1
- AWG18 | 4 | 2
- AWG20 | AWG18
- AWG20
- AWG22 | AWG22
- AWG22
- VISTA LATO CONNETTORE
  DEL RELE'
- AWG22 | AWG22 | 3 | 1
- AWG22
- AWG20 | 4 | 2
- AWG20
- AWG20
- AWG20
- AWG20 | AWG20 | AWG20 | AWG20 | AWG20 | AWG20 | AWG20 | AWG20 | AWG20 | AWG20
- AWG18
- AWG18
- AWG18
- AWG18
- AWG18
- AWG18

## Sheet 5 of 7: Cavo collegamento pc
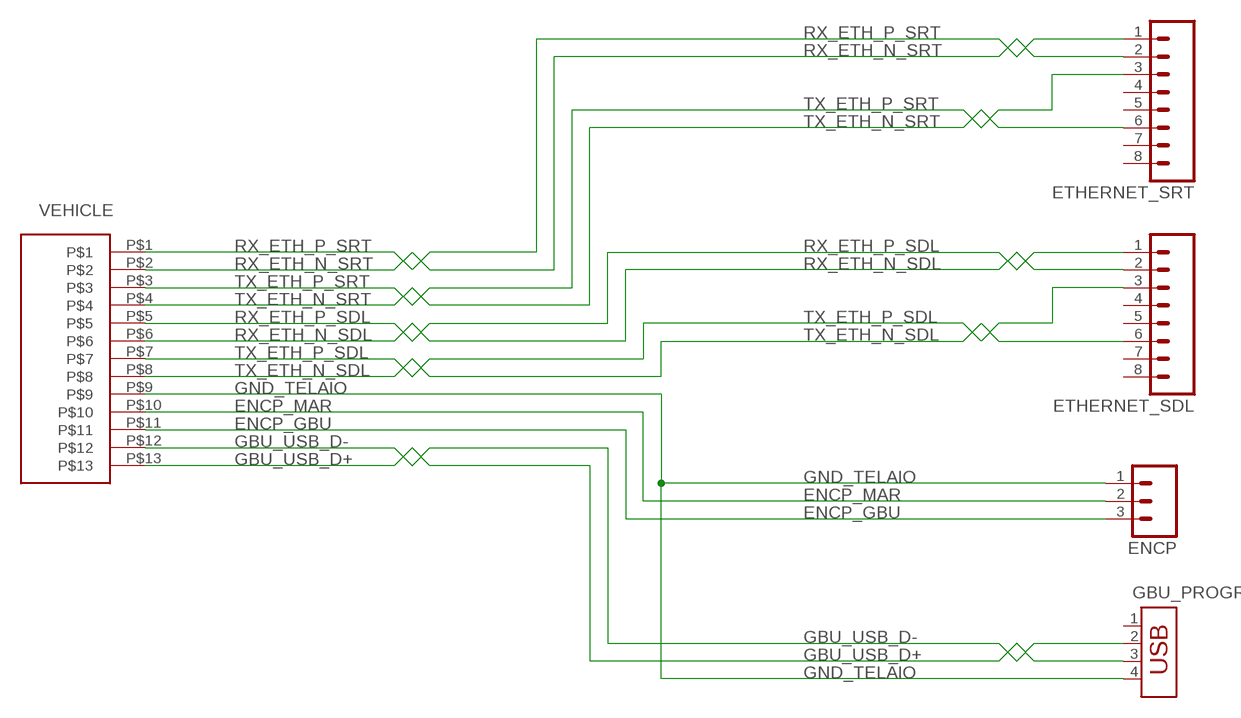
[diagram p14: schematic, sheet 5]

### Parts
ENCP  M03  [03P]
ETHERNET_SDL  M08  [08P]
ETHERNET_SRT  M08  [08P]
GBU_PROGR  USB-787616  [USB]
VEHICLE  13PIN_CONNECTOR  [NONE]

### Nets
ENCP_GBU: ENCP.3 VEHICLE.P$11 ; also sheet 1,2
ENCP_MAR: ENCP.2 VEHICLE.P$10 ; also sheet 1,2
GBU_USB_D+: GBU_PROGR.3 VEHICLE.P$13 ; also sheet 1,2
GBU_USB_D-: GBU_PROGR.2 VEHICLE.P$12 ; also sheet 1,2
GND_TELAIO: ENCP.1 GBU_PROGR.4 VEHICLE.P$9 ; also sheet 1,2,3,4,6
RX_ETH_N_SDL: ETHERNET_SDL.2 VEHICLE.P$6 ; also sheet 1,2
RX_ETH_N_SRT: ETHERNET_SRT.2 VEHICLE.P$2 ; also sheet 1,2
RX_ETH_P_SDL: ETHERNET_SDL.1 VEHICLE.P$5 ; also sheet 1,2
RX_ETH_P_SRT: ETHERNET_SRT.1 VEHICLE.P$1 ; also sheet 1,2
TX_ETH_N_SDL: ETHERNET_SDL.6 VEHICLE.P$8 ; also sheet 1,2
TX_ETH_N_SRT: ETHERNET_SRT.6 VEHICLE.P$4 ; also sheet 1,2
TX_ETH_P_SDL: ETHERNET_SDL.3 VEHICLE.P$7 ; also sheet 1,2
TX_ETH_P_SRT: ETHERNET_SRT.3 VEHICLE.P$3 ; also sheet 1,2
Unconnected: ETHERNET_SDL.4 ETHERNET_SDL.5 ETHERNET_SDL.7 ETHERNET_SDL.8 ETHERNET_SRT.4 ETHERNET_SRT.5 ETHERNET_SRT.7 ETHERNET_SRT.8 GBU_PROGR.1

## Sheet 6 of 7: Cruscotto
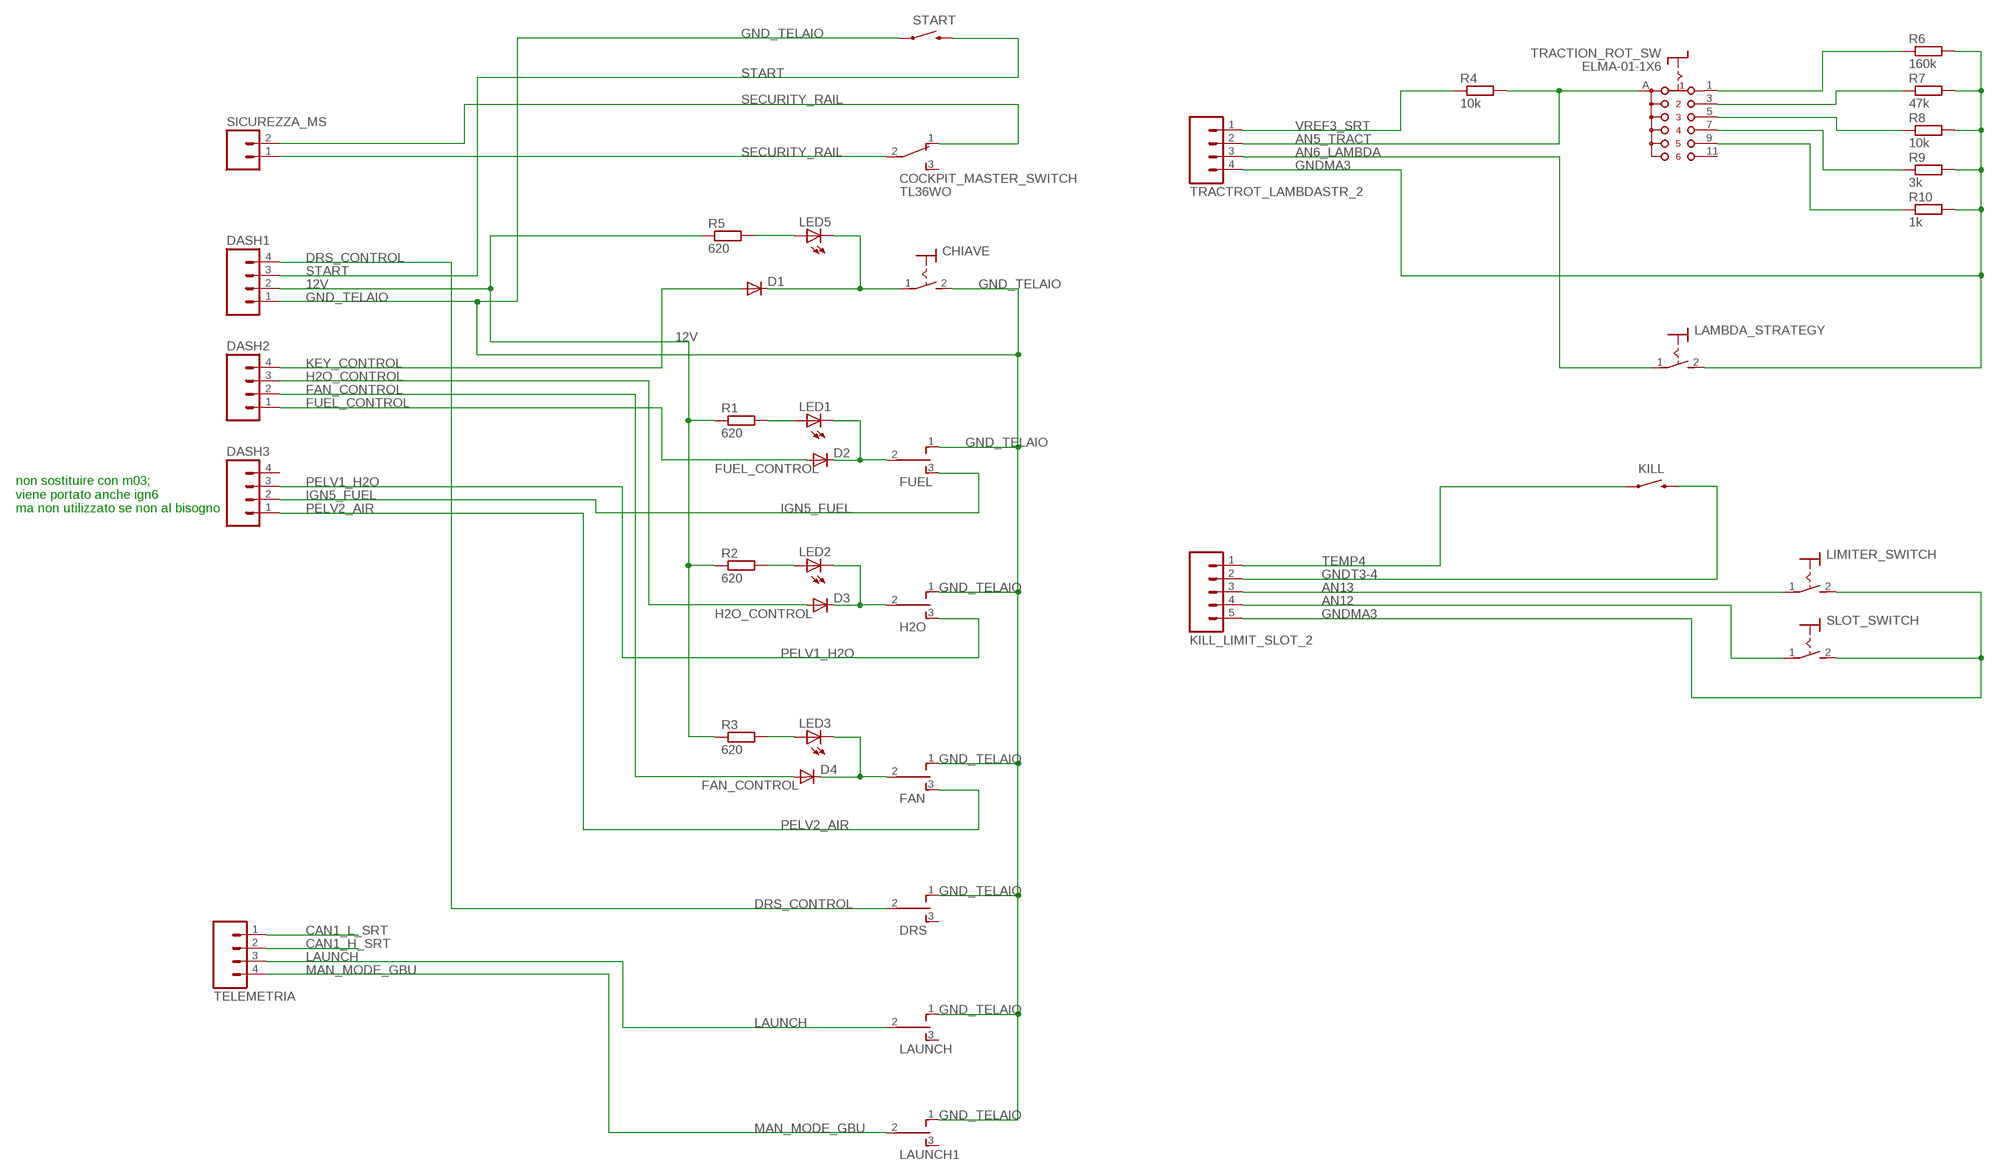
[diagram p15: schematic, sheet 6]

### Parts
CHIAVE  MS243  [MS243]
COCKPIT_MASTER_SWITCH  TL36WO  [TL3XWO]
D1  1N4148DO35-10  [DO35-10]
D2  1N4148DO35-10  [DO35-10]
D3  1N4148DO35-10  [DO35-10]
D4  1N4148DO35-10  [DO35-10]
DASH1  M04  [04P]
DASH2  M04  [04P]
DASH3  M04  [04P]
DRS  TL39YO  [TL3XYO]
FAN  TL39YO  [TL3XYO]
FUEL  TL39YO  [TL3XYO]
H2O  TL39YO  [TL3XYO]
KILL  SWITCH-MOMENTARY-2PTH  [TACTILE-PTH]
KILL_LIMIT_SLOT_2  M05  [05P]
LAMBDA_STRATEGY  MS243  [MS243]
LAUNCH  TL39YO  [TL3XYO]
LAUNCH1  TL39YO  [TL3XYO]
LED1  LED_ELD260  [LED_LD260]
LED2  LED_ELD260  [LED_LD260]
LED3  LED_ELD260  [LED_LD260]
LED5  LED_ELD260  [LED_LD260]
LIMITER_SWITCH  MS243  [MS243]
R1  620  R-EU_0204/2V  [0204V]
R2  620  R-EU_0204/2V  [0204V]
R3  620  R-EU_0204/2V  [0204V]
R4  10k  R-EU_0204/2V  [0204V]
R5  620  R-EU_0204/2V  [0204V]
R6  160k  R-EU_0204/2V  [0204V]
R7  47k  R-EU_0204/2V  [0204V]
R8  10k  R-EU_0204/2V  [0204V]
R9  3k  R-EU_0204/2V  [0204V]
R10  1k  R-EU_0204/2V  [0204V]
SICUREZZA_MS  M02  [02P]
SLOT_SWITCH  MS243  [MS243]
START  SWITCH-MOMENTARY-2PTH  [TACTILE-PTH]
TELEMETRIA  M04  [04P]
TRACTION_ROT_SW  ELMA-01-1X6  [ELMA-01-1X6]
TRACTROT_LAMBDASTR_2  M04  [04P]

### Nets
12V: DASH1.2 R1.1 R2.1 R3.1 R5.1 ; also sheet 1,2,3,4,7
AN5_TRACT: R4.2 TRACTION_ROT_SW.A(S) TRACTROT_LAMBDASTR_2.2 ; also sheet 1,2
AN6_LAMBDA: LAMBDA_STRATEGY.1(P) TRACTROT_LAMBDASTR_2.3 ; also sheet 1,2
AN12: KILL_LIMIT_SLOT_2.4 SLOT_SWITCH.1(P) ; also sheet 1,2
AN13: KILL_LIMIT_SLOT_2.3 LIMITER_SWITCH.1(P) ; also sheet 1,2
CAN1_H_SRT: TELEMETRIA.2 ; also sheet 1,2,3
CAN1_L_SRT: TELEMETRIA.1 ; also sheet 1,2,3
DRS_CONTROL: DASH1.4 DRS.2(P) ; also sheet 1,2
FAN_CONTROL: D4.A DASH2.2 ; also sheet 1,2,4,7
FUEL_CONTROL: D2.A DASH2.1 ; also sheet 1,2,4,7
GND_TELAIO: CHIAVE.2(S) DASH1.1 DRS.1(O) FAN.1(O) FUEL.1(O) H2O.1(O) LAUNCH1.1(O) LAUNCH.1(O) START.1 ; also sheet 1,2,3,4,5
GNDMA3: KILL_LIMIT_SLOT_2.5 LAMBDA_STRATEGY.2(S) LIMITER_SWITCH.2(S) R6.2 R7.2 R8.2 R9.2 R10.2 SLOT_SWITCH.2(S) TRACTROT_LAMBDASTR_2.4 ; also sheet 1
GNDT3-4: KILL.3 KILL_LIMIT_SLOT_2.2 ; also sheet 1,2
H2O_CONTROL: D3.A DASH2.3 ; also sheet 1,2,7
IGN5_FUEL: DASH3.2 FUEL.3(S) ; also sheet 1,2
KEY_CONTROL: D1.A DASH2.4 ; also sheet 1,2,4,7
LAUNCH: LAUNCH.2(P) TELEMETRIA.3 ; also sheet 1,2
MAN_MODE_GBU: LAUNCH1.2(P) TELEMETRIA.4 ; also sheet 1,2
N$2: LED1.A R1.2
N$3: CHIAVE.1(P) D1.C LED5.K(C)
N$4: D2.C FUEL.2(P) LED1.K(C)
N$5: LED2.A R2.2
N$6: LED3.A R3.2
N$8: LED5.A R5.2
N$9: D3.C H2O.2(P) LED2.K(C)
N$10: D4.C FAN.2(P) LED3.K(C)
N$21: R6.1 TRACTION_ROT_SW.1
N$22: R7.1 TRACTION_ROT_SW.3
N$23: R8.1 TRACTION_ROT_SW.5
N$24: R9.1 TRACTION_ROT_SW.7
N$27: R10.1 TRACTION_ROT_SW.9
PELV1_H2O: DASH3.3 H2O.3(S) ; also sheet 1,2
PELV2_AIR: DASH3.1 FAN.3(S) ; also sheet 1,2
SECURITY_RAIL: COCKPIT_MASTER_SWITCH.1(O) COCKPIT_MASTER_SWITCH.2(P) SICUREZZA_MS.1 SICUREZZA_MS.2 ; also sheet 7
START: DASH1.3 START.3 ; also sheet 1,2,4
TEMP4: KILL.1 KILL_LIMIT_SLOT_2.1 ; also sheet 1,2
VREF3_SRT: R4.1 TRACTROT_LAMBDASTR_2.1 ; also sheet 1,2
Unconnected: COCKPIT_MASTER_SWITCH.3(S) DASH3.4 DRS.3(S) LAUNCH1.3(S) LAUNCH.3(S) TRACTION_ROT_SW.11

### Notes on the sheet
- non sostituire con m03; 
  viene portato anche ign6 
  ma non utilizzato se non al bisogno

## Sheet 7 of 7: Scatola relè Non implementata (scopo illustrativo)
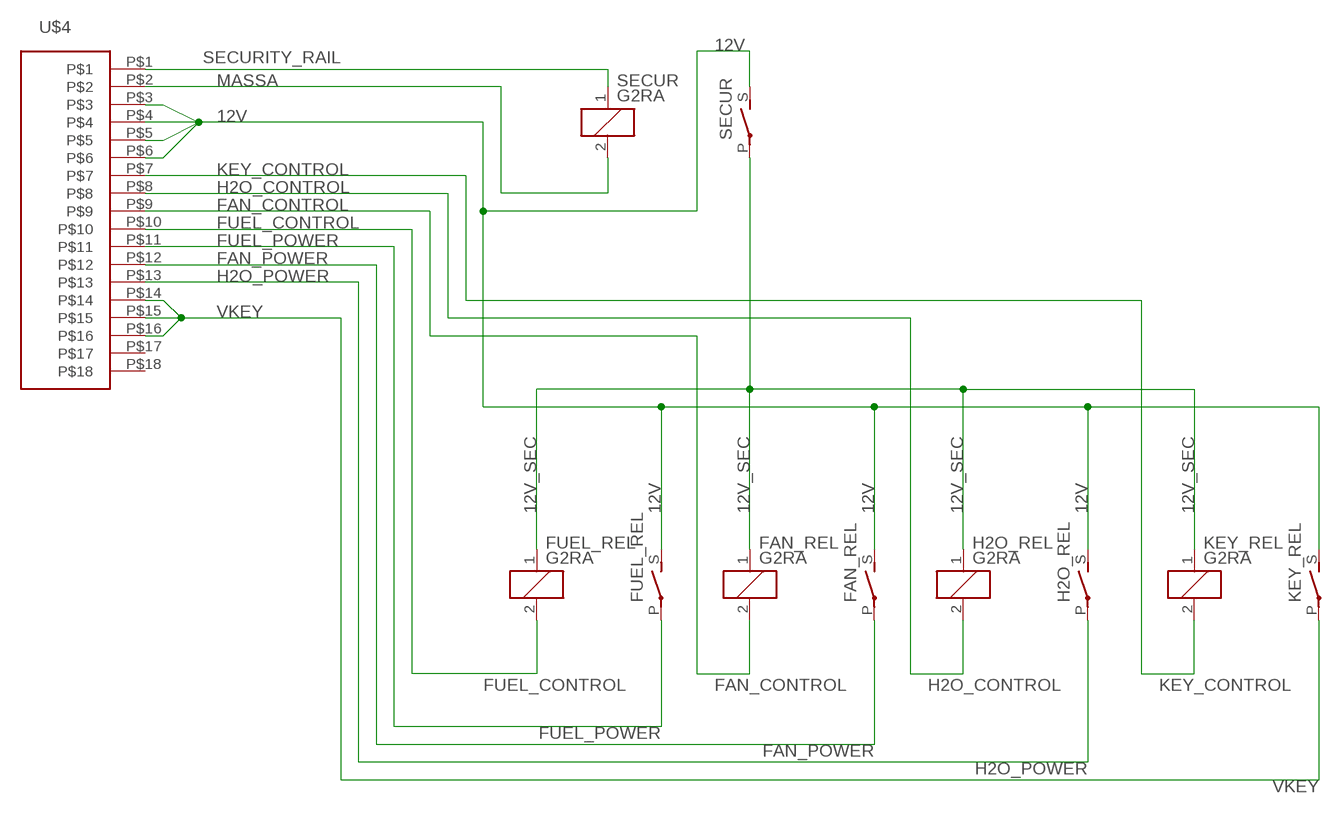
[diagram p16: schematic, sheet 7]

### Parts
FAN_REL  G2RA  [G2RA]
FUEL_REL  G2RA  [G2RA]
H2O_REL  G2RA  [G2RA]
KEY_REL  G2RA  [G2RA]
SECUR  G2RA  [G2RA]
U$4  18PIN_CONNECTOR  [NONE]

### Nets
12V: FAN_REL.S(2:S) FUEL_REL.S(2:S) H2O_REL.S(2:S) KEY_REL.S(2:S) SECUR.S(2:S) U$4.P$3 U$4.P$4 U$4.P$5 U$4.P$6 ; also sheet 1,2,3,4,6
12V_SEC: FAN_REL.1 FUEL_REL.1 H2O_REL.1 KEY_REL.1 SECUR.P(2:P)
FAN_CONTROL: FAN_REL.2 U$4.P$9 ; also sheet 1,2,4,6
FAN_POWER: FAN_REL.P(2:P) U$4.P$12
FUEL_CONTROL: FUEL_REL.2 U$4.P$10 ; also sheet 1,2,4,6
FUEL_POWER: FUEL_REL.P(2:P) U$4.P$11
H2O_CONTROL: H2O_REL.2 U$4.P$8 ; also sheet 1,2,6
H2O_POWER: H2O_REL.P(2:P) U$4.P$13
KEY_CONTROL: KEY_REL.2 U$4.P$7 ; also sheet 1,2,4,6
MASSA: SECUR.2 U$4.P$2
SECURITY_RAIL: SECUR.1 U$4.P$1 ; also sheet 6
VKEY: KEY_REL.P(2:P) U$4.P$14 U$4.P$15 U$4.P$16 ; also sheet 1,2,4
Unconnected: U$4.P$17 U$4.P$18

## Library data of the parts
12V AIR_FAN_1 AIR_FAN_2 BOT_SWITCH BRAKE_LIGHT BRAKEBUTTON CAN1 CAN1_SRT CAN2 CAN2_SDL CAN_REAR COCKPIT_SWITCH DOWN_EVALVE HB1 HB2 IGN1-IGN4 INJ1-INJ8 REG_TENS SICUREZZA_F SICUREZZA_M SICUREZZA_MS SMOT T_H2O T_OIL TEMP1-TEMP4 UP_EVALVE VREF2 WATER_PUMP = con-amp-quick:M02: AMP QUICK CONNECTOR; OC_FARNELL: unknown; OC_NEWARK: unknown
ACCELEROMETRO ANALOG_FRONT ANALOG_REAR BARRE_FRONT BARRE_REAR BSPD1 CAN_IMU CAN_LINE CRITICAL1_TPS CRITICAL2_BSE CRITICAL3 DASH1-DASH3 DASH_FRONT1-DASH_FRONT3 DIFFERENTIAL DRS_REAR EST_FL EST_FR EST_RL EST_RR FUEL_PUMP HALL_TCK_FRONT HALL_TCK_REAR MAP MOTOR_BRD MOTOR_FRONT MOTOR_REAR REL_FAN REL_FUEL REL_H2O REL_KEY REL_SEC RELE_AVV2 SUPPLY_AP TELEMETRIA TELEMETRY TRACTROT_LAMBDASTR TRACTROT_LAMBDASTR_2 = con-amp-quick:M04: AMP QUICK CONNECTOR; OC_FARNELL: unknown; OC_NEWARK: unknown
AIR_PRES APPS1 APPS2 BRAKE_TEMP_FL BRAKE_TEMP_FR BSE1 BSE2 BSPD2 DRS_SERVO ENCP GEAR INERZIALE LAP_TRIGGER P_FUEL P_OIL SCAM SENSORS SPARE_CTRL STEER SUSP_FL SUSP_FR SUSP_RL SUSP_RR TEMP_BRAKE TPS1 TPS2 WS_FL WS_FR WS_RL WS_RR = con-amp-quick:M03: AMP QUICK CONNECTOR; OC_FARNELL: unknown; OC_NEWARK: unknown
BATT_F BATT_M = con-amp-quick:M10: AMP QUICK CONNECTOR; OC_FARNELL: unknown; OC_NEWARK: unknown
BATT_NEG FUSE_IN MASTER_SW_OUT REL_AVV1 = SparkFun-Connectors:M01: Header 1 Standard 1-pin 0.1" header. Use with straight break away headers (SKU : PRT-00116), right angle break away headers (PRT-00553), swiss pins (PRT-00743), machine pins (PRT-00117), and female headers (PRT-00115). SMTSO-256-ET is a "flush mount" nut for a 4-40 screw. The older package used to be too tight, and did not allow it to sit properly thru the drill hit. The latest (0.165DIA) fits nice and snug.
CHIAVE LAMBDA_STRATEGY LIMITER_SWITCH SLOT_SWITCH = switch:MS243: TOGGLE SWITCH
COCKPIT_MASTER_SWITCH = switch:TL36WO: TINY SWITCH ON - ON Source: http://www2.produktinfo.conrad.com/datenblaetter/700000-724999/705152-da-01-de-Subminiaturschalter_TL_36WO.pdf
CONN_LOCAL = con-amp-quick:M13: AMP QUICK CONNECTOR; OC_FARNELL: unknown; OC_NEWARK: unknown
CRUSC2 CRUSCOTTO2 LAMBDA1 LAMBDA2 = con-amp-quick:M06: AMP QUICK CONNECTOR; OC_FARNELL: unknown; OC_NEWARK: unknown
D1-D4 = diode:1N4148: DIODE high speed (Philips)
DETACH_F = Motorsp_conn:37PIN_CONNECTPR
DETACH_M = Motorsport_Connector:37PIN_CONNECTOR
DRS FAN FUEL H2O LAUNCH LAUNCH1 = switch:TL39YO: TINY SWITCH ON OFF ON Source: http://www2.produktinfo.conrad.com/datenblaetter/700000-724999/705152-da-01-de-Subminiaturschalter_TL_36YO.pdf
ETH_SDL ETH_SRT ETHERNET_SDL ETHERNET_SRT GBU_SPARE1 GBU_SPARE2 = con-amp-quick:M08: AMP QUICK CONNECTOR; OC_FARNELL: unknown; OC_NEWARK: unknown
FAN_REL FUEL_REL H2O_REL KEY_REL SECUR = relay:G2RA: RELAY 1 x norm. open, Omron; OC_FARNELL: unknown; OC_NEWARK: unknown
FIREWALL_F FIREWALL_M = Motorsport_Connector:79PIN_CONNECTOR
GBU = Motorsport_Connector:GBU_AS615-35SN
GBU_PROGR = con-amp:USB-787616: AMP connector
GYRO KILL_LIMIT_SLOT KILL_LIMIT_SLOT_2 = con-amp-quick:M05: AMP QUICK CONNECTOR; OC_FARNELL: unknown; OC_NEWARK: unknown
KILL START = SparkFun-Electromechanical:SWITCH-MOMENTARY-2: Various NO switches- pushbuttons, reed, etc; PROD_ID: SWCH-08441
LED1-LED3 LED5 = eagle-ltspice:LED_E: LED Source: http://www.osram.convergy.de Source: www.luxeon.com Source: www.kingbright.com; SPICEMODEL: NONE; SPICEPREFIX: D; SPICETYPE: diode
R1-R10 = resistor:R-EU_: RESISTOR, European symbol
R11-R14 = rcl:R-EU_: RESISTOR, European symbol
TRACTION_ROT_SW = switch:ELMA-01-1X6: Rotary Switches Type 01 Source: http://www.elma.com/files/products/rotary_components/pdfs/rotary_switches_type_01_002.pdf
U$1 = Motorsport_Connector:SRT_AS618-35SA: Magneti Marelli SRT-E Connettore motorsport 66 pin
U$2 = Motorsport_Connector:SRT_AS618-35SN: Magneti Marelli STR-E Connettore Motorsport 66 pin
U$3 = Motorsport_Connector:SDL_AS618-35SN: Magneti Marelli SDL Connettore 66 pin
U$4 = Motorsp_conn:18PIN_CONNECTOR
VEHICLE = Motorsp_conn:13PIN_CONNECTOR
VOLANTE_SNAP = con-amp-quick:M12: AMP QUICK CONNECTOR; OC_FARNELL: unknown; OC_NEWARK: unknown